# EAGLE design XuLA2 (EAGLE 5.11)
AUTHOR: Dave Vandenbout / XESS Corp.; DIGIKEY#: 742C083472JPCT-ND; MANF: XILINX; MANF#: 742C083472JPTR; MOUSER#: 774-742C083472JP; VERSION#: 2.0

## Sheet 1 of 3
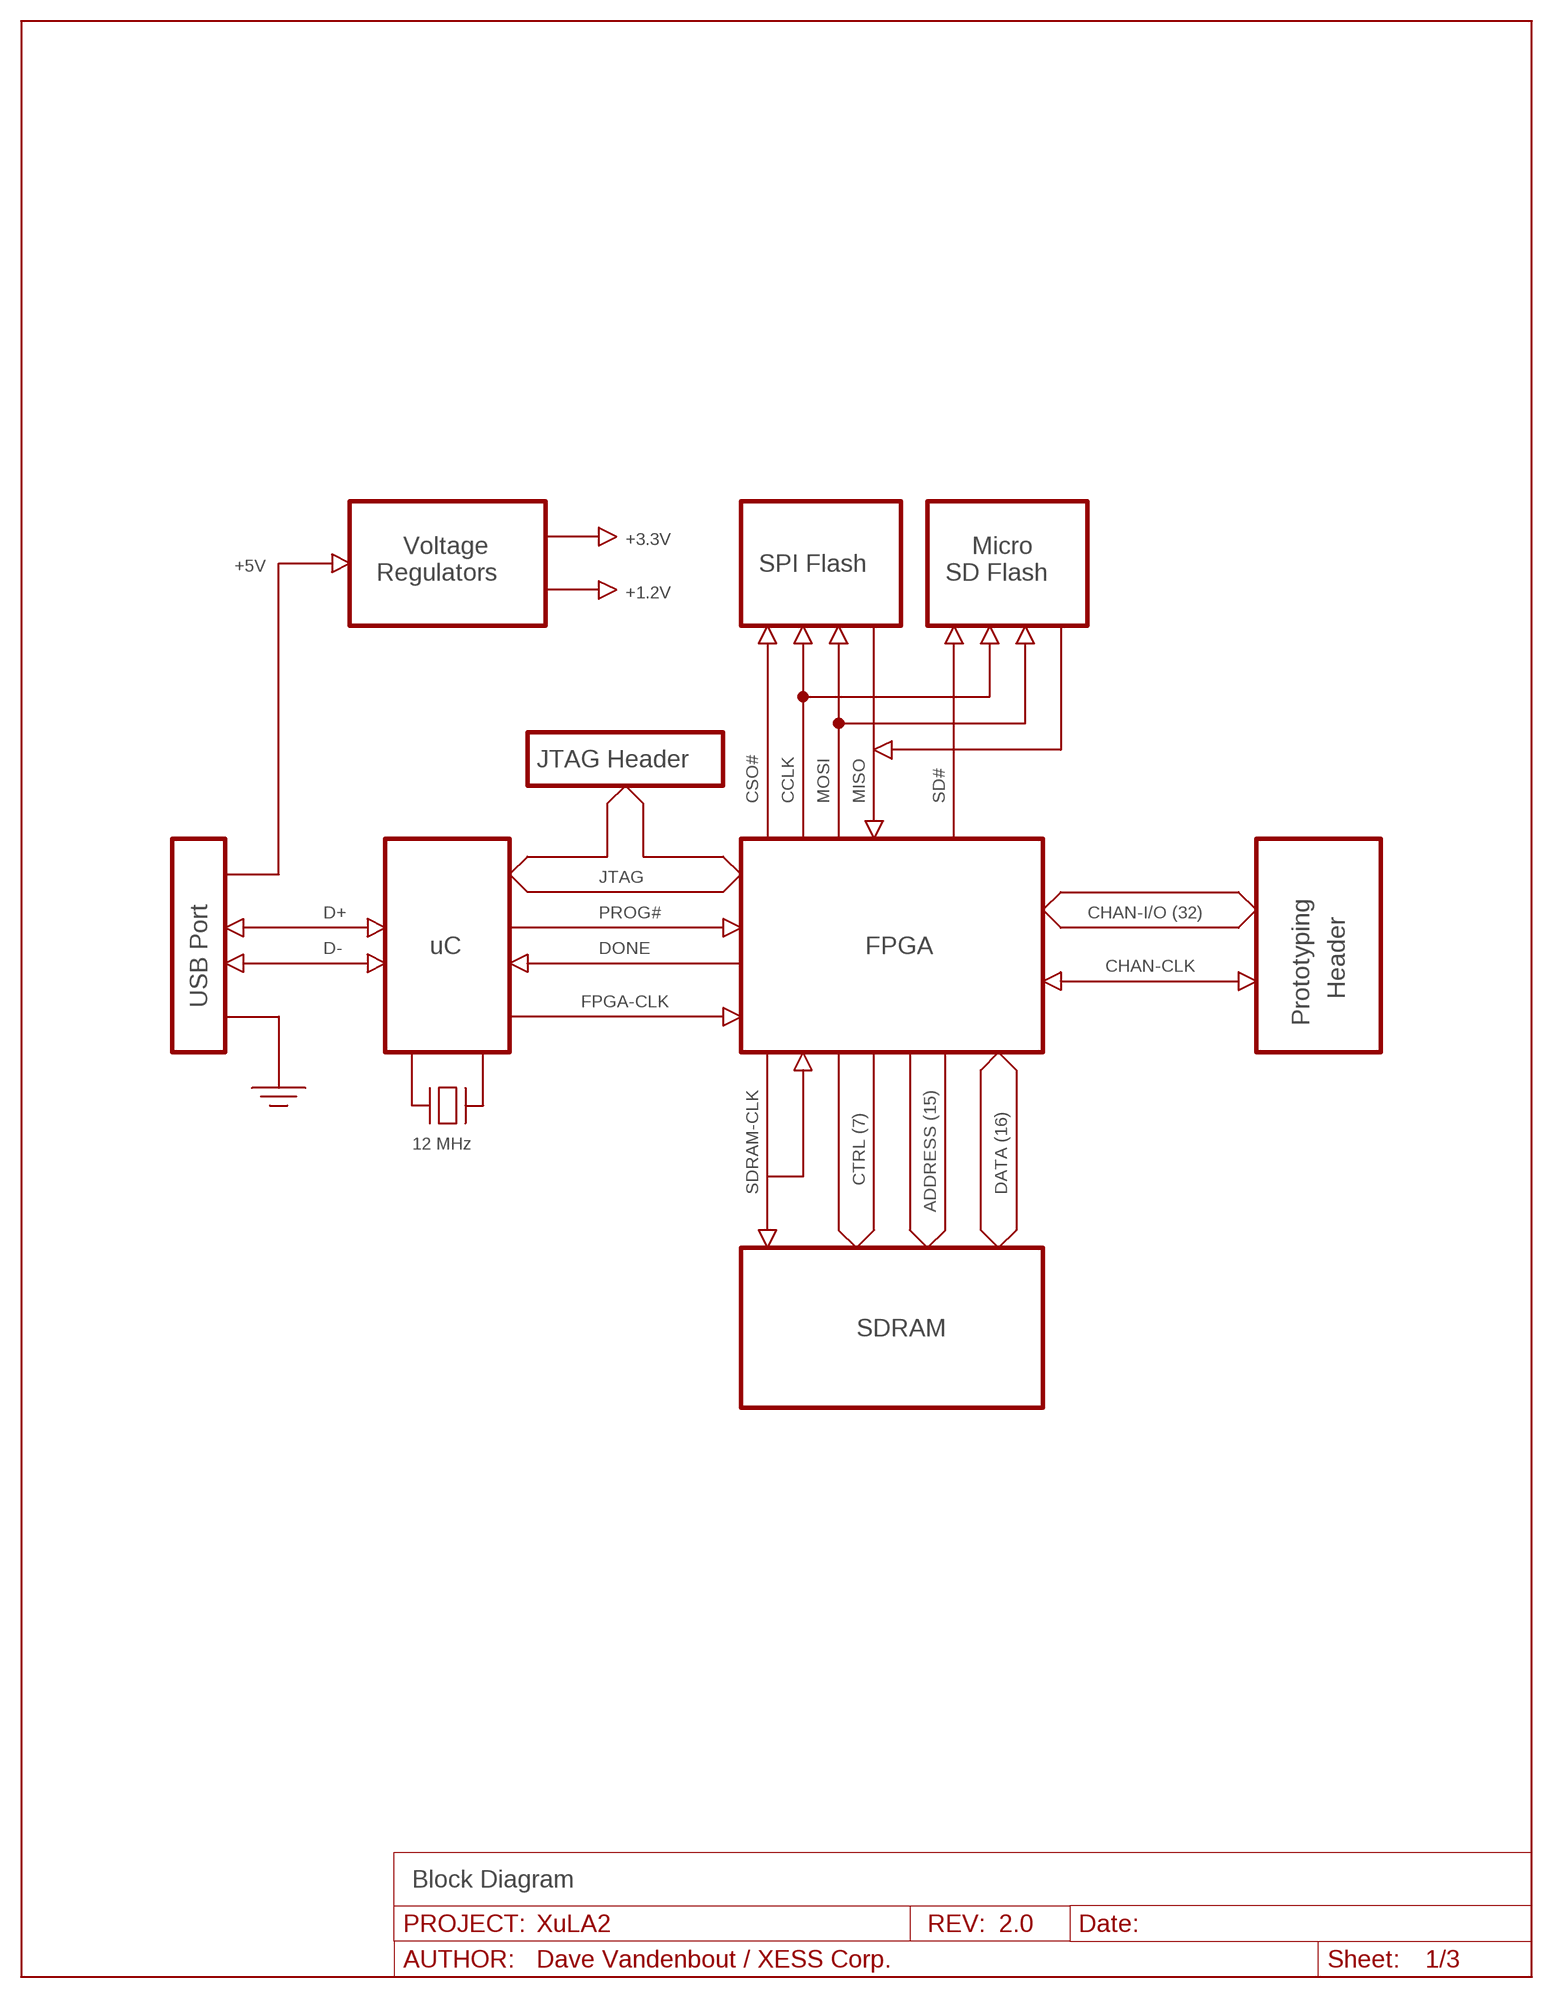
[diagram p0: schematic, sheet 1]

### Notes on the sheet
- +3.3V
- Voltage | Micro
- +5V | SPI Flash
- Regulators | SD Flash
- +1.2V
- JTAG Header
- CSO# | CCLK | MOSI | MISO | SD#
- JTAG
- D+ | PROG# | CHAN-I/O (32)
- D- | uC | DONE | FPGA
- CHAN-CLK
- Header
- USB Port | FPGA-CLK
- Prototyping
- 12 MHz
- CTRL (7)
- SDRAM-CLK | DATA (16)
- ADDRESS (15)
- SDRAM
- Block Diagram

## Sheet 2 of 3
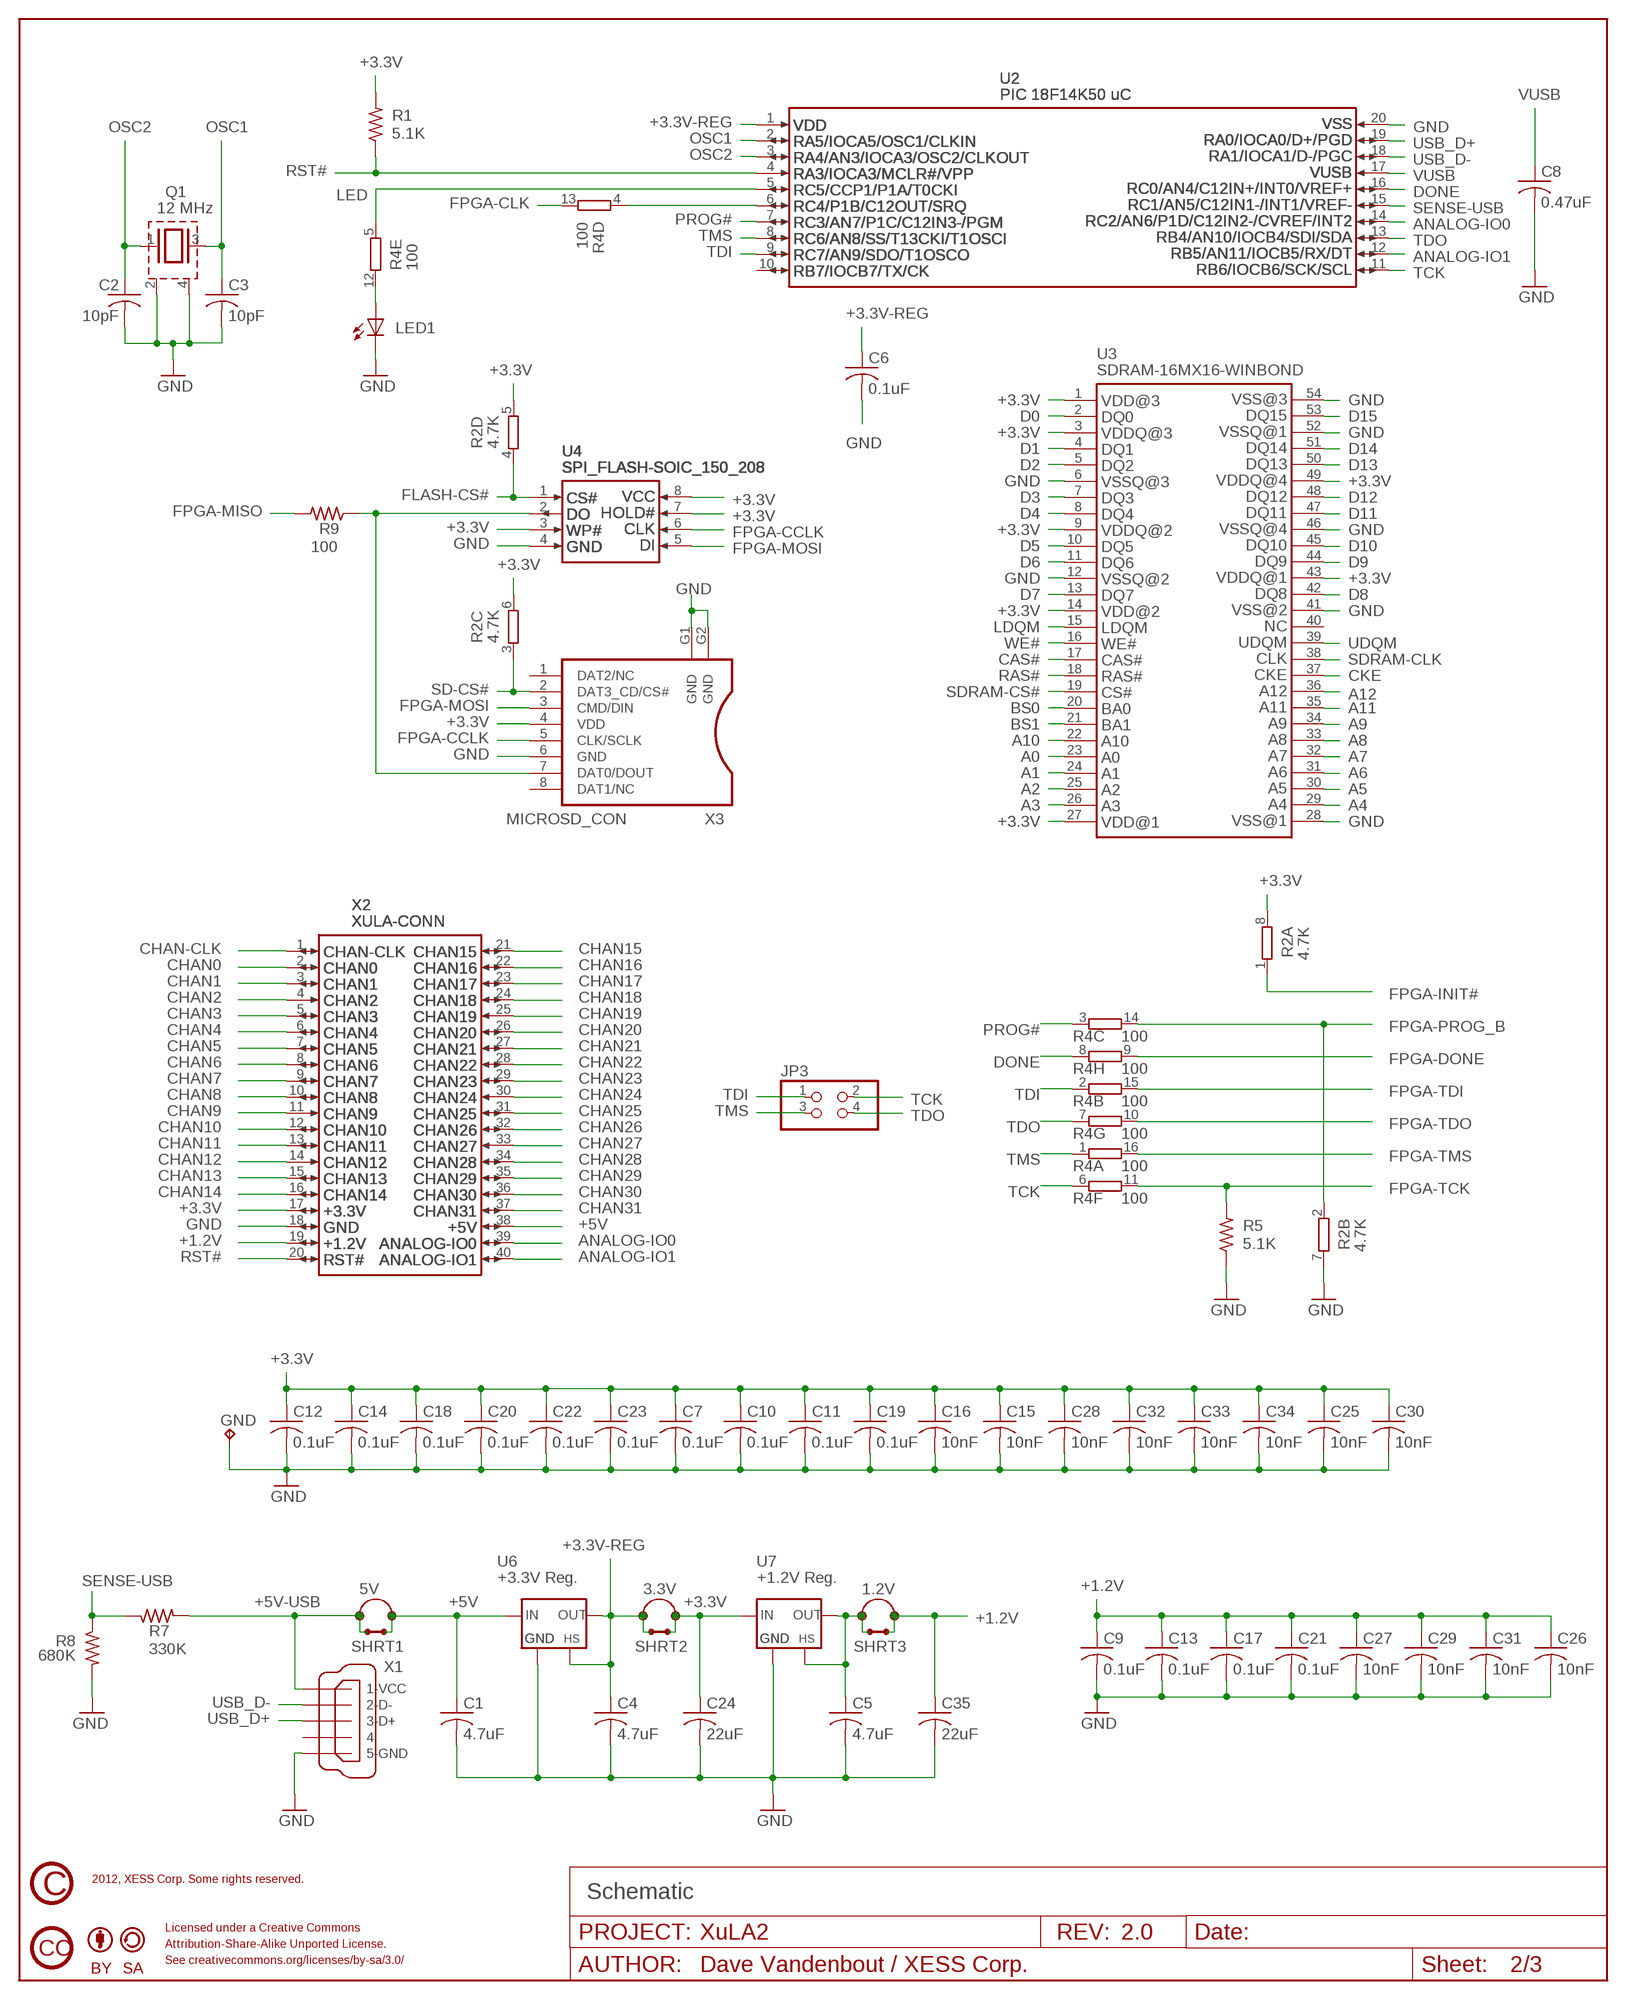
[diagram p1: schematic, sheet 2]

### Parts
1.2V  JP1QNOSILK  [JP1-NOSILK]
3.3V  JP1QNOSILK  [JP1-NOSILK]
5V  JP1QNOSILK  [JP1-NOSILK]
C1  4.7uF  C-USC0603  [C0603]
C2  10pF  C-USC0603  [C0603]
C3  10pF  C-USC0603  [C0603]
C4  4.7uF  C-USC0603  [C0603]
C5  4.7uF  C-USC0603  [C0603]
C6  0.1uF  C-USC0603  [C0603]
C7  0.1uF  C-USC0603  [C0603]
C8  0.47uF  C-USC0603  [C0603]
C9  0.1uF  C-USC0603  [C0603]
C10  0.1uF  C-USC0603  [C0603]
C11  0.1uF  C-USC0603  [C0603]
C12  0.1uF  C-USC0603  [C0603]
C13  0.1uF  C-USC0603  [C0603]
C14  0.1uF  C-USC0603  [C0603]
C15  10nF  C-USC0402  [C0402]
C16  10nF  C-USC0402  [C0402]
C17  0.1uF  C-USC0603  [C0603]
C18  0.1uF  C-USC0603  [C0603]
C19  0.1uF  C-USC0603  [C0603]
C20  0.1uF  C-USC0603  [C0603]
C21  0.1uF  C-USC0603  [C0603]
C22  0.1uF  C-USC0603  [C0603]
C23  0.1uF  C-USC0603  [C0603]
C24  22uF  C-USC1210  [C1210]
C25  10nF  C-USC0402  [C0402]
C26  10nF  C-USC0402  [C0402]
C27  10nF  C-USC0402  [C0402]
C28  10nF  C-USC0402  [C0402]
C29  10nF  C-USC0402  [C0402]
C30  10nF  C-USC0402  [C0402]
C31  10nF  C-USC0402  [C0402]
C32  10nF  C-USC0402  [C0402]
C33  10nF  C-USC0402  [C0402]
C34  10nF  C-USC0402  [C0402]
C35  22uF  C-USC1210  [C1210]
GND  TPTP-MINI  [TP-MINI]
JP3  PINHD-2X2NOSILK  [2X02-NOSILK]
LED1  LED0603  [CHIPLED-0603-TTW]
Q1  12 MHz  XTAL_CHIP32X25  [32X25]
R1  5.1K  R-US_R0603  [R0603]
R2  4.7K  RES4742  [742C083]
R4  100  RES8741X  [741X163]
R5  5.1K  R-US_R0603  [R0603]
R7  330K  R-US_R0603  [R0603]
R8  680K  R-US_R0603  [R0603]
R9  100  R-US_R0603  [R0603]
SHRT1  JSHORTWIDE  [JPSHORTW]
SHRT2  JSHORTWIDE  [JPSHORTW]
SHRT3  JSHORTWIDE  [JPSHORTW]
U2  PIC 18F14K50 uC  PIC18F14K50-I/SS  [MICROCHIP-20_SSOP]
U3  SDRAM-16MX16-WINBOND  [TSOPII-54]
U4  SPI_FLASH-SOIC_150_208  [SPI-8_SOIC_150_208]
U6  +3.3V Reg.  FAN1117  [SOT223]
U7  +1.2V Reg.  FAN1112  [SOT223]
U$2  CC_CC  [CC_CC]
U$3  CC_BY  [CC_BY]
U$4  CC_SA  [CC_SA]
U$5  CC_COPYRIGHT  [CC_COPYRIGHT]
X1  MINI-USB-UX60SC-MB-5STUX60SC-MB-5ST  MINI-USB-UX60SC-MB-5ST  [UX60SC-MB-5ST]
X2  XULA-CONN  [XULA-DIP40]
X3  MICROSD_CON  [SCHD3A0100]

### Nets
+1.2V: 1.2V.2 C9.1 C13.1 C17.1 C21.1 C26.1 C27.1 C29.1 C31.1 C35.1 SHRT3.2 X2.19 ; also sheet 3
+3.3V: 3.3V.2 C7.1 C10.1 C11.1 C12.1 C14.1 C15.1 C16.1 C18.1 C19.1 C20.1 C22.1 C23.1 C24.1 C25.1 C28.1 C30.1 C32.1 C33.1 C34.1 R1.2 R2.5 R2.6 R2.8 SHRT2.2 U3.1 U3.3 U3.9 U3.14 U3.27 U3.43 U3.49 U4.3 U4.7 U4.8 U7.3(IN) X2.17 X3.4(VDD) ; also sheet 3
+3.3V-REG: 3.3V.1 C4.1 C6.1 SHRT2.1 U2.1 U6.2(OUT) U6.4(HS)
+5V: 5V.2 C1.1 SHRT1.2 U6.3(IN) X2.38
+5V-USB: 5V.1 R7.2 SHRT1.1 X1.1(1-VCC)
A0: U3.23 ; also sheet 3
A1: U3.24 ; also sheet 3
A2: U3.25 ; also sheet 3
A3: U3.26 ; also sheet 3
A4: U3.29 ; also sheet 3
A5: U3.30 ; also sheet 3
A6: U3.31 ; also sheet 3
A7: U3.32 ; also sheet 3
A8: U3.33 ; also sheet 3
A9: U3.34 ; also sheet 3
A10: U3.22 ; also sheet 3
A11: U3.35 ; also sheet 3
A12: U3.36 ; also sheet 3
ANALOG-IO0: U2.14 X2.39
ANALOG-IO1: U2.12 X2.40
BS0: U3.20 ; also sheet 3
BS1: U3.21 ; also sheet 3
CAS#: U3.17 ; also sheet 3
CHAN0: X2.2 ; also sheet 3
CHAN1: X2.3 ; also sheet 3
CHAN2: X2.4 ; also sheet 3
CHAN3: X2.5 ; also sheet 3
CHAN4: X2.6 ; also sheet 3
CHAN5: X2.7 ; also sheet 3
CHAN6: X2.8 ; also sheet 3
CHAN7: X2.9 ; also sheet 3
CHAN8: X2.10 ; also sheet 3
CHAN9: X2.11 ; also sheet 3
CHAN10: X2.12 ; also sheet 3
CHAN11: X2.13 ; also sheet 3
CHAN12: X2.14 ; also sheet 3
CHAN13: X2.15 ; also sheet 3
CHAN14: X2.16 ; also sheet 3
CHAN15: X2.21 ; also sheet 3
CHAN16: X2.22 ; also sheet 3
CHAN17: X2.23 ; also sheet 3
CHAN18: X2.24 ; also sheet 3
CHAN19: X2.25 ; also sheet 3
CHAN20: X2.26 ; also sheet 3
CHAN21: X2.27 ; also sheet 3
CHAN22: X2.28 ; also sheet 3
CHAN23: X2.29 ; also sheet 3
CHAN24: X2.30 ; also sheet 3
CHAN25: X2.31 ; also sheet 3
CHAN26: X2.32 ; also sheet 3
CHAN27: X2.33 ; also sheet 3
CHAN28: X2.34 ; also sheet 3
CHAN29: X2.35 ; also sheet 3
CHAN30: X2.36 ; also sheet 3
CHAN31: X2.37 ; also sheet 3
CHAN-CLK: X2.1 ; also sheet 3
CKE: U3.37 ; also sheet 3
D0: U3.2 ; also sheet 3
D1: U3.4 ; also sheet 3
D2: U3.5 ; also sheet 3
D3: U3.7 ; also sheet 3
D4: U3.8 ; also sheet 3
D5: U3.10 ; also sheet 3
D6: U3.11 ; also sheet 3
D7: U3.13 ; also sheet 3
D8: U3.42 ; also sheet 3
D9: U3.44 ; also sheet 3
D10: U3.45 ; also sheet 3
D11: U3.47 ; also sheet 3
D12: U3.48 ; also sheet 3
D13: U3.50 ; also sheet 3
D14: U3.51 ; also sheet 3
D15: U3.53 ; also sheet 3
DONE: R4.8 U2.16
FLASH-CS#: R2.4 U4.1 ; also sheet 3
FPGA-CCLK: U4.6 X3.5(CLK/SCLK) ; also sheet 3
FPGA-CLK: R4.13 ; also sheet 3
FPGA-DONE: R4.9 ; also sheet 3
FPGA-INIT#: R2.1 ; also sheet 3
FPGA-MISO: R9.2 ; also sheet 3
FPGA-MOSI: U4.5 X3.3(CMD/DIN) ; also sheet 3
FPGA-PROG_B: R2.2 R4.14 ; also sheet 3
FPGA-TCK: R4.11 R5.2 ; also sheet 3
FPGA-TDI: R4.15 ; also sheet 3
FPGA-TDO: R4.10 ; also sheet 3
FPGA-TMS: R4.16 ; also sheet 3
GND: C1.2 C2.2 C3.2 C4.2 C5.2 C6.2 C7.2 C8.2 C9.2 C10.2 C11.2 C12.2 C13.2 C14.2 C15.2 C16.2 C17.2 C18.2 C19.2 C20.2 C21.2 C22.2 C23.2 C24.2 C25.2 C26.2 C27.2 C28.2 C29.2 C30.2 C31.2 C32.2 C33.2 C34.2 C35.2 GND.1(TP) LED1.C Q1.2 Q1.4 R2.7 R5.1 R8.2 U2.20 U3.6 U3.12 U3.28 U3.41 U3.46 U3.52 U3.54 U4.4 U6.1(GND) U7.1(GND) X1.5(5-GND) X2.18 X3.6(GND) X3.G1(GND) X3.G2(GND) ; also sheet 3
LDQM: U3.15 ; also sheet 3
LED: R4.5 U2.5
N$2: 1.2V.1 C5.1 SHRT3.1 U7.2(OUT) U7.4(HS)
N$7: R4.4 U2.6
N$8: R9.1 U4.2 X3.7(DAT0/DOUT)
N$11: LED1.A R4.12
OSC1: C3.1 Q1.3 U2.2
OSC2: C2.1 Q1.1 U2.3
PROG#: R4.3 U2.7
RAS#: U3.18 ; also sheet 3
RST#: R1.1 U2.4 X2.20
SD-CS#: R2.3 X3.2(DAT3_CD/CS#) ; also sheet 3
SDRAM-CLK: U3.38 ; also sheet 3
SDRAM-CS#: U3.19 ; also sheet 3
SENSE-USB: R7.1 R8.1 U2.15
TCK: JP3.2 R4.6 U2.11
TDI: JP3.1 R4.2 U2.9
TDO: JP3.4 R4.7 U2.13
TMS: JP3.3 R4.1 U2.8
UDQM: U3.39 ; also sheet 3
USB_D+: U2.19 X1.3(3-D+)
USB_D-: U2.18 X1.2(2-D-)
VUSB: C8.1 U2.17
WE#: U3.16 ; also sheet 3
Unconnected: U2.10 U3.40 X1.4 X3.1(DAT2/NC) X3.8(DAT1/NC)

### Notes on the sheet
- 2012, XESS Corp. Some rights reserved.
- Schematic
- Licensed under a Creative Commons
- Attribution-Share-Alike Unported License.
- See creativecommons.org/licenses/by-sa/3.0/

## Sheet 3 of 3
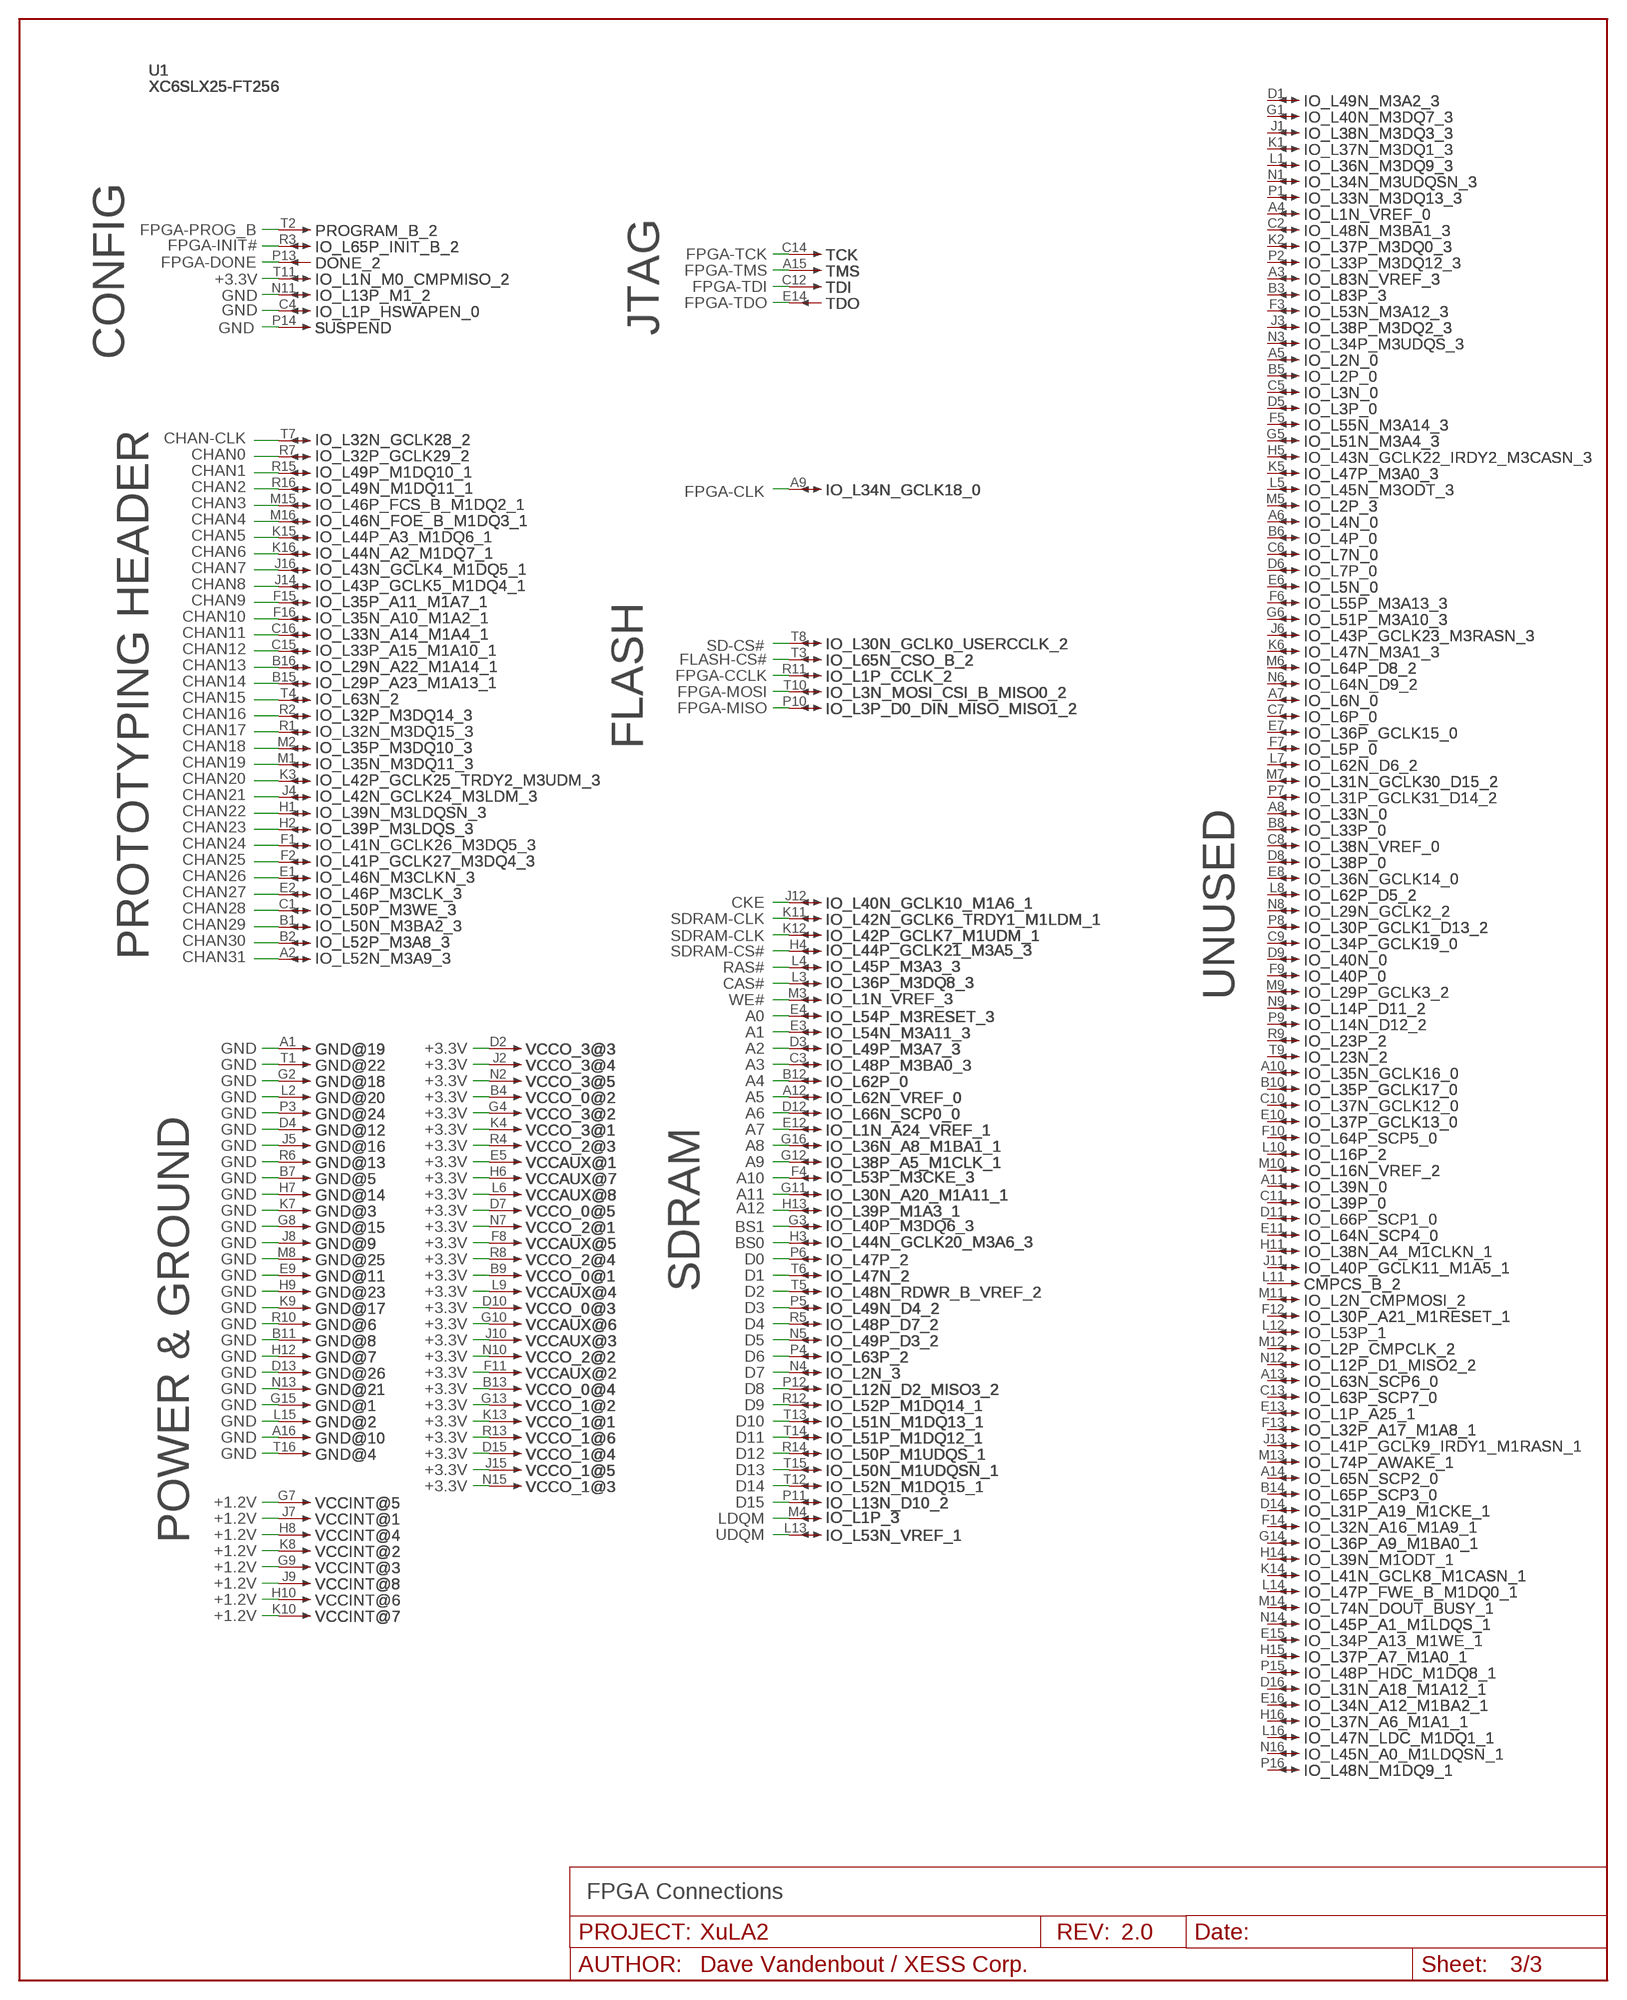
[diagram p2: schematic, sheet 3]

### Parts
U1  XC6SLX25-FT256  [XILINX-FT256]

### Nets
+1.2V: U1.G7 U1.G9 U1.H8 U1.H10 U1.J7 U1.J9 U1.K8 U1.K10 ; also sheet 2
+3.3V: U1.B4 U1.B9 U1.B13 U1.D2 U1.D7 U1.D10 U1.D15 U1.E5 U1.F8 U1.F11 U1.G4 U1.G10 U1.G13 U1.H6 U1.J2 U1.J10 U1.J15 U1.K4 U1.K13 U1.L6 U1.L9 U1.N2 U1.N7 U1.N10 U1.N15 U1.R4 U1.R8 U1.R13 U1.T11 ; also sheet 2
A0: U1.E4 ; also sheet 2
A1: U1.E3 ; also sheet 2
A2: U1.D3 ; also sheet 2
A3: U1.C3 ; also sheet 2
A4: U1.B12 ; also sheet 2
A5: U1.A12 ; also sheet 2
A6: U1.D12 ; also sheet 2
A7: U1.E12 ; also sheet 2
A8: U1.G16 ; also sheet 2
A9: U1.G12 ; also sheet 2
A10: U1.F4 ; also sheet 2
A11: U1.G11 ; also sheet 2
A12: U1.H13 ; also sheet 2
BS0: U1.H3 ; also sheet 2
BS1: U1.G3 ; also sheet 2
CAS#: U1.L3 ; also sheet 2
CHAN0: U1.R7 ; also sheet 2
CHAN1: U1.R15 ; also sheet 2
CHAN2: U1.R16 ; also sheet 2
CHAN3: U1.M15 ; also sheet 2
CHAN4: U1.M16 ; also sheet 2
CHAN5: U1.K15 ; also sheet 2
CHAN6: U1.K16 ; also sheet 2
CHAN7: U1.J16 ; also sheet 2
CHAN8: U1.J14 ; also sheet 2
CHAN9: U1.F15 ; also sheet 2
CHAN10: U1.F16 ; also sheet 2
CHAN11: U1.C16 ; also sheet 2
CHAN12: U1.C15 ; also sheet 2
CHAN13: U1.B16 ; also sheet 2
CHAN14: U1.B15 ; also sheet 2
CHAN15: U1.T4 ; also sheet 2
CHAN16: U1.R2 ; also sheet 2
CHAN17: U1.R1 ; also sheet 2
CHAN18: U1.M2 ; also sheet 2
CHAN19: U1.M1 ; also sheet 2
CHAN20: U1.K3 ; also sheet 2
CHAN21: U1.J4 ; also sheet 2
CHAN22: U1.H1 ; also sheet 2
CHAN23: U1.H2 ; also sheet 2
CHAN24: U1.F1 ; also sheet 2
CHAN25: U1.F2 ; also sheet 2
CHAN26: U1.E1 ; also sheet 2
CHAN27: U1.E2 ; also sheet 2
CHAN28: U1.C1 ; also sheet 2
CHAN29: U1.B1 ; also sheet 2
CHAN30: U1.B2 ; also sheet 2
CHAN31: U1.A2 ; also sheet 2
CHAN-CLK: U1.T7 ; also sheet 2
CKE: U1.J12 ; also sheet 2
D0: U1.P6 ; also sheet 2
D1: U1.T6 ; also sheet 2
D2: U1.T5 ; also sheet 2
D3: U1.P5 ; also sheet 2
D4: U1.R5 ; also sheet 2
D5: U1.N5 ; also sheet 2
D6: U1.P4 ; also sheet 2
D7: U1.N4 ; also sheet 2
D8: U1.P12 ; also sheet 2
D9: U1.R12 ; also sheet 2
D10: U1.T13 ; also sheet 2
D11: U1.T14 ; also sheet 2
D12: U1.R14 ; also sheet 2
D13: U1.T15 ; also sheet 2
D14: U1.T12 ; also sheet 2
D15: U1.P11 ; also sheet 2
FLASH-CS#: U1.T3 ; also sheet 2
FPGA-CCLK: U1.R11 ; also sheet 2
FPGA-CLK: U1.A9 ; also sheet 2
FPGA-DONE: U1.P13 ; also sheet 2
FPGA-INIT#: U1.R3 ; also sheet 2
FPGA-MISO: U1.P10 ; also sheet 2
FPGA-MOSI: U1.T10 ; also sheet 2
FPGA-PROG_B: U1.T2 ; also sheet 2
FPGA-TCK: U1.C14 ; also sheet 2
FPGA-TDI: U1.C12 ; also sheet 2
FPGA-TDO: U1.E14 ; also sheet 2
FPGA-TMS: U1.A15 ; also sheet 2
GND: U1.A1 U1.A16 U1.B7 U1.B11 U1.C4 U1.D4 U1.D13 U1.E9 U1.G2 U1.G8 U1.G15 U1.H7 U1.H9 U1.H12 U1.J5 U1.J8 U1.K7 U1.K9 U1.L2 U1.L15 U1.M8 U1.N11 U1.N13 U1.P3 U1.P14 U1.R6 U1.R10 U1.T1 U1.T16 ; also sheet 2
LDQM: U1.M4 ; also sheet 2
RAS#: U1.L4 ; also sheet 2
SD-CS#: U1.T8 ; also sheet 2
SDRAM-CLK: U1.K11 U1.K12 ; also sheet 2
SDRAM-CS#: U1.H4 ; also sheet 2
UDQM: U1.L13 ; also sheet 2
WE#: U1.M3 ; also sheet 2
Unconnected: U1.A3 U1.A4 U1.A5 U1.A6 U1.A7 U1.A8 U1.A10 U1.A11 U1.A13 U1.A14 U1.B3 U1.B5 U1.B6 U1.B8 U1.B10 U1.B14 U1.C2 U1.C5 U1.C6 U1.C7 U1.C8 U1.C9 U1.C10 U1.C11 U1.C13 U1.D1 U1.D5 U1.D6 U1.D8 U1.D9 U1.D11 U1.D14 U1.D16 U1.E6 U1.E7 U1.E8 U1.E10 U1.E11 U1.E13 U1.E15 U1.E16 U1.F3 U1.F5 U1.F6 U1.F7 U1.F9 U1.F10 U1.F12 U1.F13 U1.F14 U1.G1 U1.G5 U1.G6 U1.G14 U1.H5 U1.H11 U1.H14 U1.H15 U1.H16 U1.J1 U1.J3 U1.J6 U1.J11 U1.J13 U1.K1 U1.K2 U1.K5 U1.K6 U1.K14 U1.L1 U1.L5 U1.L7 U1.L8 U1.L10 U1.L11 U1.L12 U1.L14 U1.L16 U1.M5 U1.M6 U1.M7 U1.M9 U1.M10 U1.M11 U1.M12 U1.M13 U1.M14 U1.N1 U1.N3 U1.N6 U1.N8 U1.N9 U1.N12 U1.N14 U1.N16 U1.P1 U1.P2 U1.P7 U1.P8 U1.P9 U1.P15 U1.P16 U1.R9 U1.T9

### Notes on the sheet
- JTAG
- CONFIG
- FLASH
- PROTOTYPING HEADER
- UNUSED
- SDRAM
- POWER & GROUND
- FPGA Connections

## Library data of the parts
1.2V 3.3V 5V = xess:JP1Q: JUMPER
C1-C35 = rcl:C-US: CAPACITOR, American symbol
GND = xess:TP: Test Point
JP3 = pinhead:PINHD-2X2: PIN HEADER
LED1 = xess:LED: LED
Q1 = xess:XTAL_CHIP: Crystal Chip; DIGIKEY#: 535-10901-1-ND; MANF: Abracon; MANF#: ABM8G-12.000MHZ-4Y-T3; MOUSER#: 815-ABM8G-12-B4Y-T
R1 R5 R7-R9 = rcl:R-US_: RESISTOR, American symbol
R2 = xess:RES4: Resistor 4-pack Package of four resistors.; DIGIKEY#: 742C083???JPCT-ND; MANF: CTS Resistor Products; MANF#: 742C083???JPTR; MOUSER#: 774-742C083???JP
R4 = xess:RES8: Resistor 8-pack Package of eight resistors.
SHRT1-SHRT3 = xess:JSHORT: Bridge
U1 = xess:XC6SLX25-FT256: Xilinx Spartan 6 25-KLUT FPGA in FT256 package
U2 = xess:PIC18F14K50: Microchip PIC 18F14K50 Microcontroller; DIGIKEY#: PIC18F14K50-I/SS-ND; MANF: Microchip; MANF#: PIC18F14K50-I/SS; MOUSER#: 579-PIC18F14K50-I/SS
U3 = xess:SDRAM-16MX16; MANF: Winbond; MANF#: W9825G6JH-5
U4 = xess:SPI_FLASH: SPI Flash; MANF: Winbond
U6 = xess:FAN1117: +3.3V Linear Regulator
U7 = xess:FAN1112: +1.2V Linear Regulator
U$2 = xess:CC_CC
U$3 = xess:CC_BY
U$4 = xess:CC_SA
U$5 = xess:CC_COPYRIGHT
X1 = xess:MINI-USB-: MINI USB Connector Source: http://www.hirose.co.jp/cataloge_hp/e24000019.pdf; DIGIKEY#: H11671CT-ND; MANF: Hirose; MANF#: UX60SC-MB-5ST; MOUSER#: 798-UX60SC-MB-5ST
X2 = xess:XULA-CONN: XuLA Board Connector
X3 = xess:MICROSD_CON: MicroSD Card Connector

## Net classes
1 power: clearance 0.254 mm

## Board
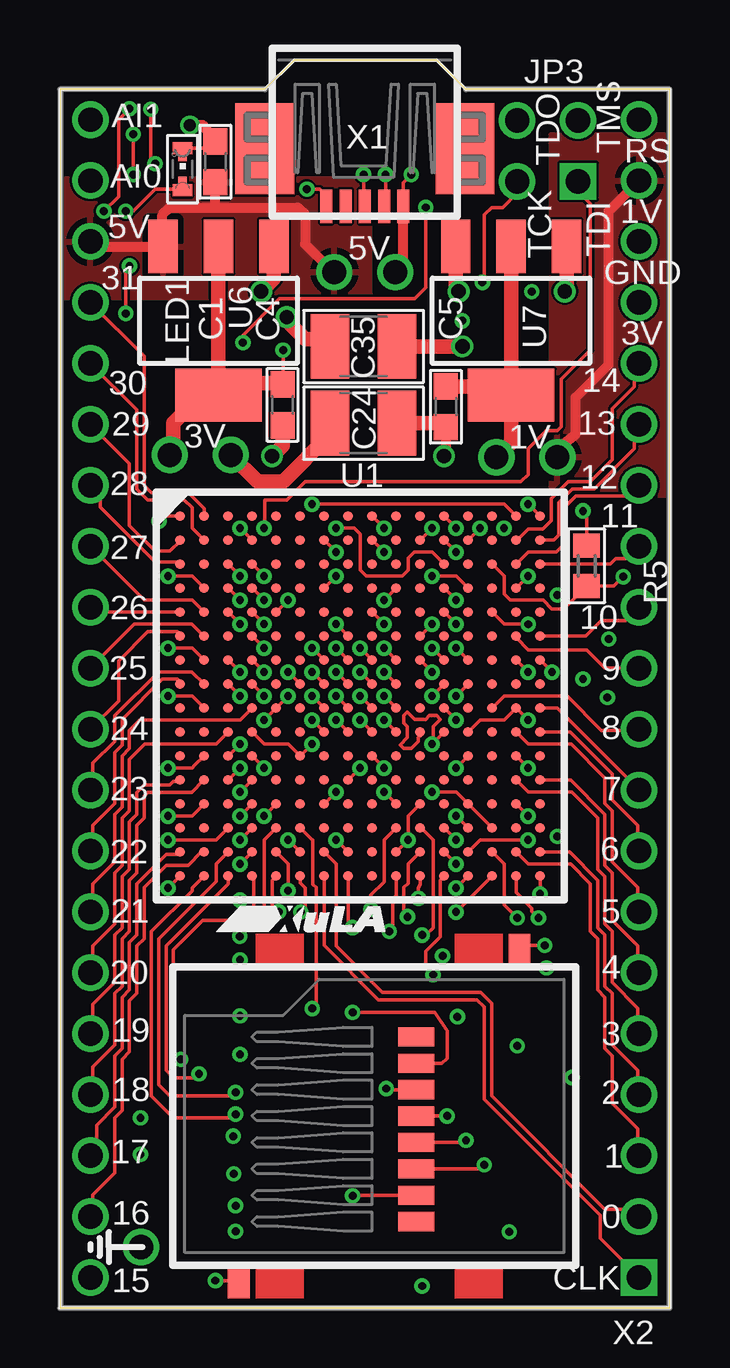
[diagram p3: board, top side]
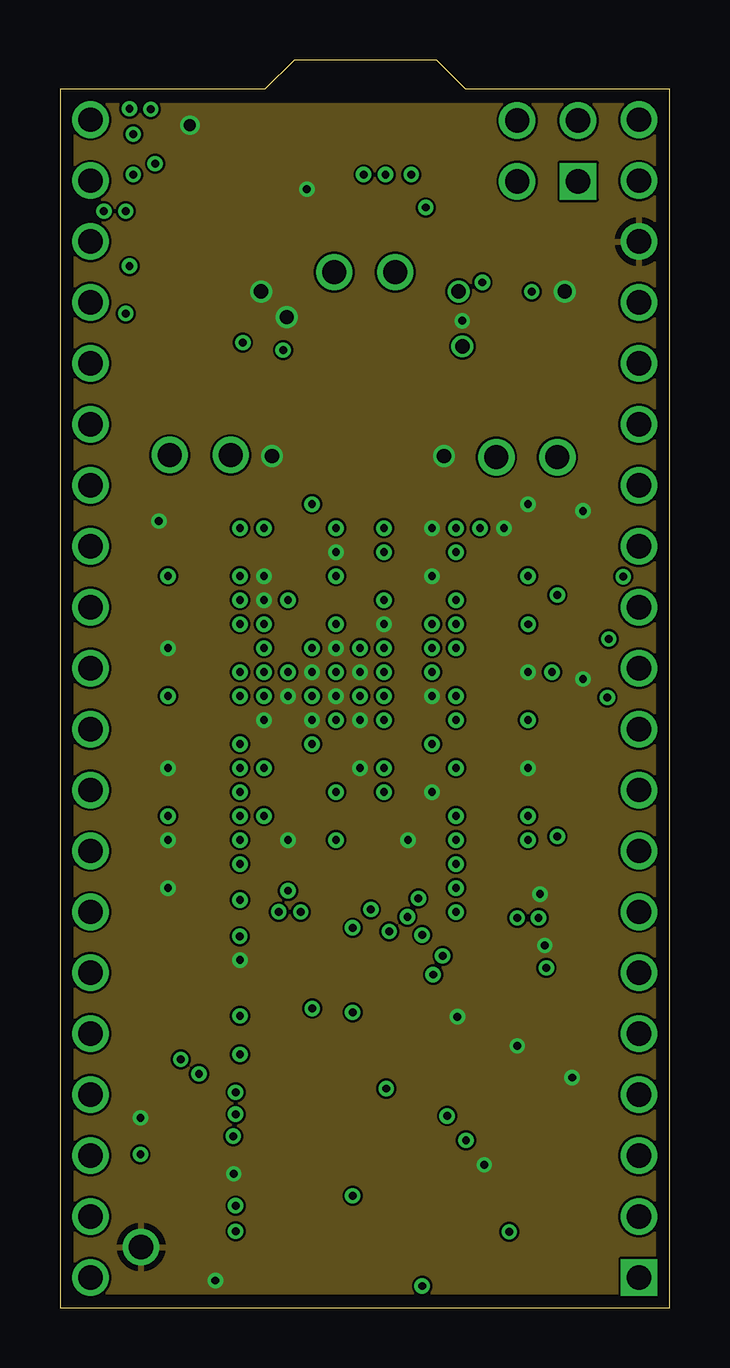
[diagram p4: board, inner layer Route2]
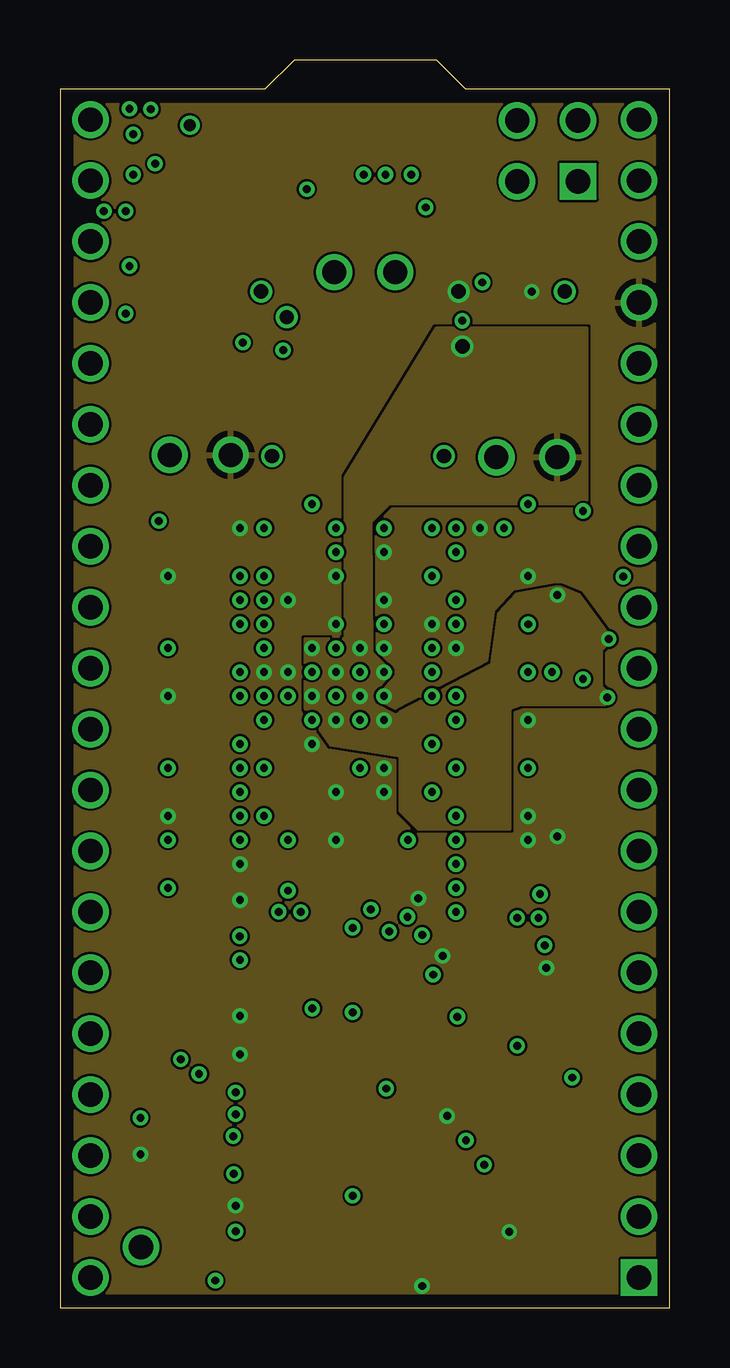
[diagram p5: board, inner layer Route3]
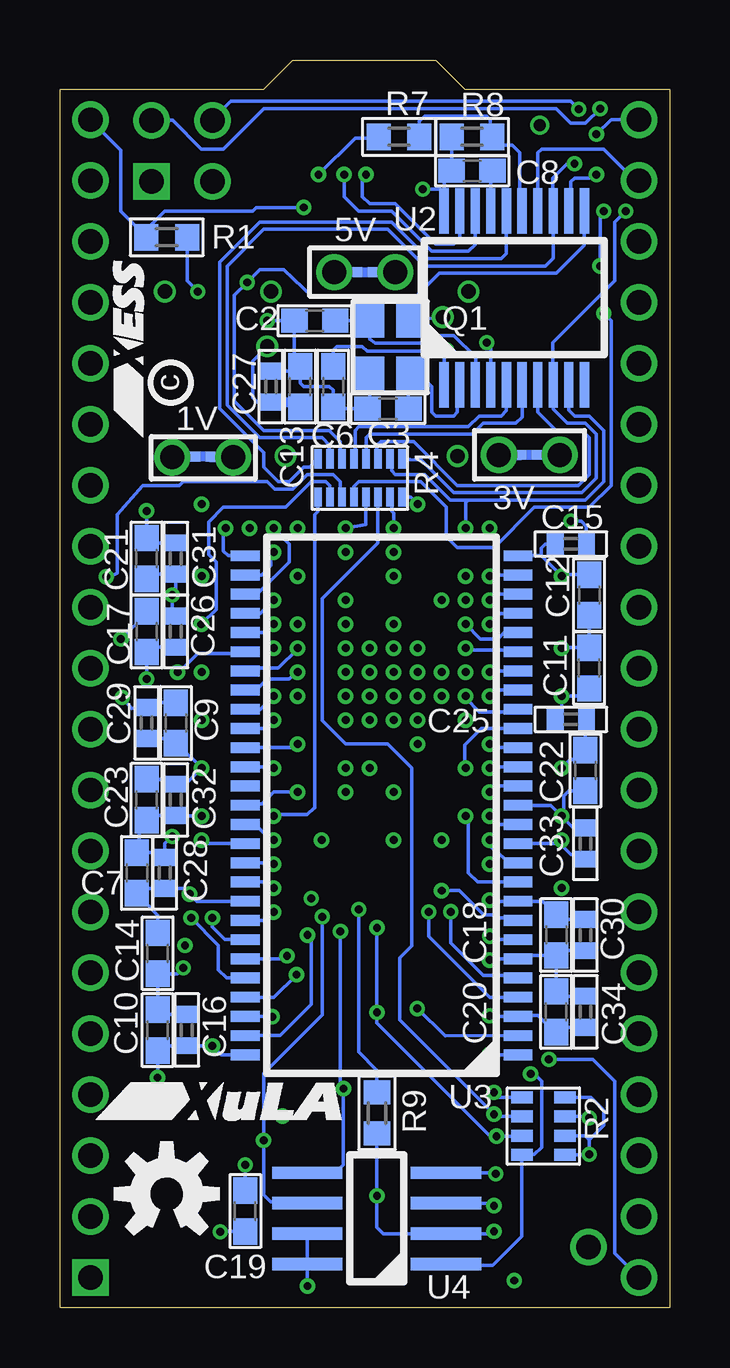
[diagram p6: board, bottom side, seen from below]

Size 25.4 x 52.02 mm. Coordinates in mm from the lower left corner, seen from the top.
Outline: 0,50.8 0,0 25.4,0 25.4,50.8 16.92,50.8 15.7,52.02 9.75,52.02 8.53,50.8 0,50.8
Copper layers (1*2*3*16): Top 0.035mm / dielectric 0.126mm / Route2 0.035mm / dielectric 1.626mm / Route3 0.035mm / dielectric 0.126mm / Bottom 0.035mm
Design rules "SEP_4layer *": minimum track width 5mil, minimum drill 10mil, track to track 0.1mm, track to pad 0.1295mm, pad to pad 0.1mm, via to via 0.1mm, smd to smd 0.1mm, copper to edge 0.15mm, drill to drill 0.2mm, minimum pad ring 10mil, minimum via ring 6mil, stop-mask expansion 2mil, vias tented up to drill 0.6071mm, thermal gap 10mil

### Footprints (pad centres in the part's own frame; a part is rotated, then mirrored left to right if it is on the bottom)
JP1-NOSILK = drill 1 round: 1 0,-1.27; 2 0,1.27
C0603 = smd 1.1 x 1: 1 -0.85,0; 2 0.85,0
C0402 = smd 0.7 x 0.9: 1 -0.65,0; 2 0.65,0
C1210 = smd 1.6 x 2.7: 1 -1.4,0; 2 1.4,0
TP-MINI = drill 1.016 round: 1 0,0
2X02-NOSILK = drill 1.016 square: 1 -1.27,-1.27 | drill 1.016 round: 2 -1.27,1.27; 3 1.27,-1.27; 4 1.27,1.27
CHIPLED-0603-TTW = smd 0.8 x 0.5: A 0,-0.875; C 0,0.875 | smd 0.35 x 0.35: A@1 0,-0.5; C@1 0,0.5
32X25 = smd 1.2 x 1.4: 1 0,0; 2 0,-2.2; 3 1.7,-2.2; 4 1.7,0
R0603 = smd 1 x 1.1: 1 -0.85,0; 2 0.85,0
742C083 = smd 0.5 x 0.9: 1 -0.4,-0.9; 2 0.4,-0.9; 3 1.2,-0.9; 4 2,-0.9; 5 2,0.9; 6 1.2,0.9; 7 0.4,0.9; 8 -0.4,0.9
741X163 = smd 0.3 x 0.8: 1 -1.75,-0.8; 2 -1.25,-0.8; 3 -0.75,-0.8; 4 -0.25,-0.8; 5 0.25,-0.8; 6 0.75,-0.8; 7 1.25,-0.8; 8 1.75,-0.8; 9 1.75,0.8; 10 1.25,0.8; 11 0.75,0.8; 12 0.25,0.8; 13 -0.25,0.8; 14 -0.75,0.8; 15 -1.25,0.8; 16 -1.75,0.8
JPSHORTW = smd 0.406 x 0.406: 1 0,0; 2 0.635,0
XILINX-FT256 = smd 0.4 x 0.4: A1 0,0; A2 1,0; A3 2,0; A4 3,0; A5 4,0; A6 5,0; A7 6,0; A8 7,0; A9 8,0; A10 9,0; A11 10,0; A12 11,0; A13 12,0; A14 13,0; A15 14,0; A16 15,0; B1 0,-1; B2 1,-1; B3 2,-1; B4 3,-1; B5 4,-1; B6 5,-1; B7 6,-1; B8 7,-1; B9 8,-1; B10 9,-1; B11 10,-1; B12 11,-1; B13 12,-1; B14 13,-1; B15 14,-1; B16 15,-1; C1 0,-2; C2 1,-2; C3 2,-2; C4 3,-2; C5 4,-2; C6 5,-2; C7 6,-2; C8 7,-2; C9 8,-2; C10 9,-2; C11 10,-2; C12 11,-2; C13 12,-2; C14 13,-2; C15 14,-2; C16 15,-2; D1 0,-3; D2 1,-3; D3 2,-3; D4 3,-3; D5 4,-3; D6 5,-3; D7 6,-3; D8 7,-3; D9 8,-3; D10 9,-3; D11 10,-3; D12 11,-3; D13 12,-3; D14 13,-3; D15 14,-3; D16 15,-3; E1 0,-4; E2 1,-4; E3 2,-4; E4 3,-4; E5 4,-4; E6 5,-4; E7 6,-4; E8 7,-4; E9 8,-4; E10 9,-4; E11 10,-4; E12 11,-4; E13 12,-4; E14 13,-4; E15 14,-4; E16 15,-4; F1 0,-5; F2 1,-5; F3 2,-5; F4 3,-5; F5 4,-5; F6 5,-5; F7 6,-5; F8 7,-5; F9 8,-5; F10 9,-5; F11 10,-5; F12 11,-5; F13 12,-5; F14 13,-5; F15 14,-5; F16 15,-5; G1 0,-6; G2 1,-6; G3 2,-6; G4 3,-6; G5 4,-6; G6 5,-6; G7 6,-6; G8 7,-6; G9 8,-6; G10 9,-6; G11 10,-6; G12 11,-6; G13 12,-6; G14 13,-6; G15 14,-6; G16 15,-6; H1 0,-7; H2 1,-7; H3 2,-7; H4 3,-7; H5 4,-7; H6 5,-7; H7 6,-7; H8 7,-7; H9 8,-7; H10 9,-7; H11 10,-7; H12 11,-7; H13 12,-7; H14 13,-7; H15 14,-7; H16 15,-7; J1 0,-8; J2 1,-8; J3 2,-8; J4 3,-8; J5 4,-8; J6 5,-8; J7 6,-8; J8 7,-8; J9 8,-8; J10 9,-8; J11 10,-8; J12 11,-8; J13 12,-8; J14 13,-8; J15 14,-8; J16 15,-8; K1 0,-9; K2 1,-9; K3 2,-9; K4 3,-9; K5 4,-9; K6 5,-9; K7 6,-9; K8 7,-9; K9 8,-9; K10 9,-9; K11 10,-9; K12 11,-9; K13 12,-9; K14 13,-9; K15 14,-9; K16 15,-9; L1 0,-10; L2 1,-10; L3 2,-10; L4 3,-10; L5 4,-10; L6 5,-10; L7 6,-10; L8 7,-10; L9 8,-10; L10 9,-10; L11 10,-10; L12 11,-10; L13 12,-10; L14 13,-10; L15 14,-10; L16 15,-10; M1 0,-11; M2 1,-11; M3 2,-11; M4 3,-11; M5 4,-11; M6 5,-11; M7 6,-11; M8 7,-11; M9 8,-11; M10 9,-11; M11 10,-11; M12 11,-11; M13 12,-11; M14 13,-11; M15 14,-11; M16 15,-11; N1 0,-12; N2 1,-12; N3 2,-12; N4 3,-12; N5 4,-12; N6 5,-12; N7 6,-12; N8 7,-12; N9 8,-12; N10 9,-12; N11 10,-12; N12 11,-12; N13 12,-12; N14 13,-12; N15 14,-12; N16 15,-12; P1 0,-13; P2 1,-13; P3 2,-13; P4 3,-13; P5 4,-13; P6 5,-13; P7 6,-13; P8 7,-13; P9 8,-13; P10 9,-13; P11 10,-13; P12 11,-13; P13 12,-13; P14 13,-13; P15 14,-13; P16 15,-13; R1 0,-14; R2 1,-14; R3 2,-14; R4 3,-14; R5 4,-14; R6 5,-14; R7 6,-14; R8 7,-14; R9 8,-14; R10 9,-14; R11 10,-14; R12 11,-14; R13 12,-14; R14 13,-14; R15 14,-14; R16 15,-14; T1 0,-15; T2 1,-15; T3 2,-15; T4 3,-15; T5 4,-15; T6 5,-15; T7 6,-15; T8 7,-15; T9 8,-15; T10 9,-15; T11 10,-15; T12 11,-15; T13 12,-15; T14 13,-15; T15 14,-15; T16 15,-15
MICROCHIP-20_SSOP = smd 1.89 x 0.38: 1 0,0; 2 0,-0.65; 3 0,-1.3; 4 0,-1.95; 5 0,-2.6; 6 0,-3.25; 7 0,-3.9; 8 0,-4.55; 9 0,-5.2; 10 0,-5.85; 11 7.25,-5.85; 12 7.25,-5.2; 13 7.25,-4.55; 14 7.25,-3.9; 15 7.25,-3.25; 16 7.25,-2.6; 17 7.25,-1.95; 18 7.25,-1.3; 19 7.25,-0.65; 20 7.25,0
TSOPII-54 = smd 1.2 x 0.45: 1 0,0; 2 0,-0.8; 3 0,-1.6; 4 0,-2.4; 5 0,-3.2; 6 0,-4; 7 0,-4.8; 8 0,-5.6; 9 0,-6.4; 10 0,-7.2; 11 0,-8; 12 0,-8.8; 13 0,-9.6; 14 0,-10.4; 15 0,-11.2; 16 0,-12; 17 0,-12.8; 18 0,-13.6; 19 0,-14.4; 20 0,-15.2; 21 0,-16; 22 0,-16.8; 23 0,-17.6; 24 0,-18.4; 25 0,-19.2; 26 0,-20; 27 0,-20.8; 28 11.36,-20.8; 29 11.36,-20; 30 11.36,-19.2; 31 11.36,-18.4; 32 11.36,-17.6; 33 11.36,-16.8; 34 11.36,-16; 35 11.36,-15.2; 36 11.36,-14.4; 37 11.36,-13.6; 38 11.36,-12.8; 39 11.36,-12; 40 11.36,-11.2; 41 11.36,-10.4; 42 11.36,-9.6; 43 11.36,-8.8; 44 11.36,-8; 45 11.36,-7.2; 46 11.36,-6.4; 47 11.36,-5.6; 48 11.36,-4.8; 49 11.36,-4; 50 11.36,-3.2; 51 11.36,-2.4; 52 11.36,-1.6; 53 11.36,-0.8; 54 11.36,0
SPI-8_SOIC_150_208 = smd 2.921 x 0.51: 1 1.06,0; 2 1.06,-1.27; 3 1.06,-2.54; 4 1.06,-3.81; 5 6.839,-3.81; 6 6.839,-2.54; 7 6.839,-1.27; 8 6.839,0
SOT223 = smd 1.219 x 2.235: 1 -2.311,-3.099; 2 0,-3.099; 3 2.311,-3.099 | smd 3.6 x 2.2: 4 0,3.099
UX60SC-MB-5ST = smd 1.4 x 0.5: 1 6.1,1.6; 2 6.1,0.8; 3 6.1,0; 4 6.1,-0.8; 5 6.1,-1.6 | smd 3.8 x 2.449: M1 3.7,-4.175; M2 3.7,4.175
XULA-DIP40 = drill 1.016 square: 1 49.53,24.13 | drill 1.016 round: 2 46.99,24.13; 3 44.45,24.13; 4 41.91,24.13; 5 39.37,24.13; 6 36.83,24.13; 7 34.29,24.13; 8 31.75,24.13; 9 29.21,24.13; 10 26.67,24.13; 11 24.13,24.13; 12 21.59,24.13; 13 19.05,24.13; 14 16.51,24.13; 15 13.97,24.13; 16 11.43,24.13; 17 8.89,24.13; 18 6.35,24.13; 19 3.81,24.13; 20 1.27,24.13; 21 49.53,1.27; 22 46.99,1.27; 23 44.45,1.27; 24 41.91,1.27; 25 39.37,1.27; 26 36.83,1.27; 27 34.29,1.27; 28 31.75,1.27; 29 29.21,1.27; 30 26.67,1.27; 31 24.13,1.27; 32 21.59,1.27; 33 19.05,1.27; 34 16.51,1.27; 35 13.97,1.27; 36 11.43,1.27; 37 8.89,1.27; 38 6.35,1.27; 39 3.81,1.27; 40 1.27,1.27
SCHD3A0100 = smd 0.8 x 1.5: 1 3.3,-10.15; 2 2.2,-10.15; 3 1.1,-10.15; 4 0,-10.15; 5 -1.1,-10.15; 6 -2.2,-10.15; 7 -3.3,-10.15; 8 -4.4,-10.15 | smd 1.45 x 0.9: G1 6.875,-14.45; G2 -6.875,-2.75

### Placement (x,y rotation side)
1.2V  19.46,35.46 270 top
3.3V  5.84,35.56 270 top
5V  12.7,43.18 90 top
C1  6.48,47.78 90 top
C2  14.78,41.15 180 bottom
C3  11.73,37.49 180 bottom
C4  9.27,37.64 270 top
C5  16.08,37.57 270 top
C6  14.02,38.4 270 bottom
C7  22.2,18.14 270 bottom
C8  8.23,47.4 180 bottom
C9  20.57,24.38 270 bottom
C10  21.34,11.58 270 bottom
C11  3.35,26.67 90 bottom
C12  3.35,29.72 270 bottom
C13  15.39,38.4 90 bottom
C14  21.34,14.78 90 bottom
C15  4.11,31.85 0 bottom
C16  20.12,11.58 270 bottom
C17  21.79,28.19 270 bottom
C18  4.72,15.54 270 bottom
C19  17.68,4.04 90 bottom
C20  4.72,12.34 90 bottom
C21  21.79,31.24 90 bottom
C22  3.51,22.4 90 bottom
C23  21.79,21.18 90 bottom
C24  12.65,36.88 0 top
C25  4.11,24.54 0 bottom
C26  20.57,28.19 270 bottom
C27  16.61,38.4 90 bottom
C28  21.03,18.14 270 bottom
C29  21.79,24.38 270 bottom
C30  3.51,15.54 270 bottom
C31  20.57,31.24 90 bottom
C32  20.57,21.18 90 bottom
C33  3.51,19.35 270 bottom
C34  3.51,12.34 90 bottom
C35  12.65,40.08 180 top
GND  3.38,2.54 0 top
JP3  20.32,48.23 90 top
LED1  5.11,47.47 0 top
Q1  12.5,41.15 0 bottom
R1  20.95,44.63 0 bottom
R2  5.26,8.38 270 bottom
R4  12.9,34.59 180 bottom
R5  21.95,30.94 270 top
R7  11.28,48.82 180 bottom
R8  8.23,48.82 180 bottom
R9  12.19,8.13 90 bottom
SHRT1  13,43.18 0 bottom
SHRT2  5.54,35.56 180 bottom
SHRT3  19.13,35.48 180 bottom
U1  5,33 0 top
U2  9.4,38.48 90 bottom
U3  6.32,10.55 180 bottom
U4  8.26,1.83 180 bottom
U6  6.6,41.15 180 top
U7  18.8,41.15 180 top
U$2  -1.91,-15.88 0 top  (outside the outline)
U$3  5.08,-14.61 0 top  (outside the outline)
U$4  10.16,-14.61 0 top  (outside the outline)
U$5  -1.91,-6.99 0 top  (outside the outline)
X1  12.7,52.02 270 top
X2  0,50.8 270 top
X3  4.7,8 90 top

### Tracks (layer width: path | path; a pad name or v marks a point on that pad's centre or on a via)
+1.2V  (via drill 0.33, 0.6)
  Top 0.152: U1.G7 v10.5,27.5 | U1.H8 v11.5,26.5 | U1.H10 v13.5,26.5 | U1.K10 v13.5,24.5 | U1.J9 v12.5,25.5 | U1.J7 v10.5,25.5 | U1.K8 v11.5,24.5 | v12.5,27.5 U1.G9
  Top 0.406: 1.2V.2 20.73,35.81 21.49,36.42 21.49,37.95 22.86,39.32 22.86,45.72 X2.19
  Top 0.61: C35.1 v16.76,40.08
  Bottom 0.152: C26.1 20.73,29 v20.73,29.72 20.57,29.87 C31.1 21.59,30.59 C21.1 | C17.1 21.79,28.96 v22.86,27.89 | v22.81,25.45 22.4,24.99 C29.1 21.59,25.23 C9.1 | C27.1 17.18,37.76 17.37,37.95 17.37,39.47 v16.76,40.08
  Bottom 0.406: C27.1 15.59,37.76 C13.1 | SHRT3.2 20.7,35.48 1.2V.2
  pour Route3: 10.21,27.89 10.21,24.99 11.28,23.47 14.17,23.01 14.17,20.73 14.94,19.96 18.75,19.96 18.75,24.99 19.2,25.15 22.71,25.15 22.96,25.4 22.96,25.5 22.56,25.91 22.56,27.43 22.96,27.84 22.96,27.91 21.64,29.72 20.78,30.07 19.02,29.77 18.29,28.96 17.98,26.82 14.17,24.84 14.02,24.69 13.11,25.15 13.08,25.17 13.08,25.65 13.79,26.52 12.98,27.33 12.95,32.77 13.72,33.53 21.95,33.53 21.95,40.84 15.7,40.84 11.89,34.59 11.89,27.89
  pour Top: 25.45,48.92 20.42,48.92 20.42,33.83 25.45,33.83
+3.3V  (via drill 0.33, 0.6)
  Top 0.152: v7.5,32.5 U1.B4 | U1.E5 v9.5,29.5 | U1.D7 v11.5,30.5 | U1.F8 v11.5,28.5 | U1.B9 v13.5,31.5 | U1.D10 v13.5,29.5 | U1.G10 v13.5,27.5 | U1.F11 v15.5,28.5 | U1.J10 v13.5,25.5 | v13.5,22.5 U1.L9 | v10.5,23.5 U1.L6 9.5,23.5 8.5,23.5 U1.K4 | U1.N7 v11.5,21.5 | U1.R8 v11.5,19.5 | U1.N10 v13.5,21.5 | U1.D15 v19.5,30.5 | U1.B13 v17.5,32.5 | U1.G4 v8.5,26.5 | U1.H6 v9.5,26.5 | U1.G13 v16.5,27.5 | U1.N15 v19.5,20.5 | U1.R13 17.5,19.5 v19.5,19.5 | v19.5,24.5 U1.J15 18.5,24.5 17.5,24.5 U1.K13 | U1.D2 5.5,30.5 v4.5,30.5 | U1.N2 5.5,20.5 v4.5,20.5 | v7.5,18.5 U1.R4 | U1.J2 5.5,25.5 v4.5,25.5 | U1.T11 15,17.65 14.94,17.5 v14.94,17.07 | X3.4 v16.13,8
  Top 0.61: U7.3 16.48,42.65 v16.61,42.37 | 7.16,35.51 3.3V.2 8.23,34.44 9.3,34.44 11.25,36.4 C24.1
  Bottom 0.152: 5.35,31.35 U3.27 | 5.35,31.35 v4.5,30.5 4.43,30.57 C12.1 | v7.5,17 7.43,16.95 U3.9 5.28,16.95 C18.1 4.52,16.2 C30.1 | v7.5,12.18 7.45,12.15 U3.3 6.28,12.19 5.49,12.19 4.79,11.49 C20.1 4.52,11.69 C34.1 | U3.1 7.2,10.55 v7.5,10.58 | U3.49 16.12,14.55 v15.94,14.68 | U3.43 19.35,19.35 v19.5,19.5 | C33.1 4,20 v4.5,20.5 | U3.14 4.95,20.95 v4.5,20.5 | C22.1 4.2,21.55 4.42,21.34 4.42,20.58 v4.5,20.5 | U4.3 7.57,4.37 v7.32,4.27 | U4.7 U4.8 15.09,1.07 v15.09,0.91 | 5.35,31.35 5.35,31.68 5.18,31.85 C15.1 | C11.1 3.67,25.5 v4.5,25.5 4.5,24.8 C25.1 | v19.5,20.5 20.54,20.5 C32.1 21.59,20.53 C23.1 21.79,20.27 22.1,19.96 22.1,19.14 C7.1 21.23,18.99 C28.1 21.03,19.36 v20.73,19.66 | C16.1 21.14,12.23 C10.1 C14.1 20.51,13.93 v20.27,14.17 | R1.2 20.11,42.81 v19.66,42.37 | R2.8 3.3,8.78 2.74,8.23 2.74,7.62 3.35,7.01 | 3.35,7.01 v3.35,6.4 3.37,6.38 R2.5 | R2.6 3.52,7.18 3.35,7.01 | C19.1 18.66,3.19 v18.72,3.17
  Bottom 0.406: 3.3V.2 SHRT2.2
  pour Route3 (rank 2): 0.64,50.16 24.77,50.16 24.77,0.64 0.64,0.64
+3.3V-REG  (via drill 0.33)
  Top 0.152: v9.3,39.93 9.3,38.86 9.45,38.67 C4.1
  Top 0.406: 5.89,38.05 U6.4
  Top 0.61: 5.89,38.05 4.72,36.88 4.72,35.71 3.3V.1 | U6.2 U6.4 7.11,38.05 7.62,38.56 9.21,38.56 C4.1
  Bottom 0.152: U2.1 9.4,39.88 v9.3,39.93 9.37,39.93 9.42,39.88 12.6,39.88 12.8,40.08 13.87,40.08 14.02,39.93 C6.1
  Bottom 0.406: 3.3V.1 SHRT2.1
+5V
  Top 0.406: 5V.2 11.43,43.13 10.21,44.35 10.21,45.57 9.91,45.87 6.4,45.87 | 6.4,45.87 4.57,45.87 4.27,45.57 4.27,44.22 U6.3 1.47,44.25 X2.38 | C1.1 6.48,45.95 6.4,45.87
  Bottom 0.406: 5V.2 SHRT1.2
  pour Top: 0,47.09 12.95,47.09 12.95,42.06 0,42.06
+5V-USB  (via drill 0.33)
  Top 0.152: X1.1 14.3,46.91 v14.63,47.24
  Top 0.406: X1.1 14.3,43.51 5V.1
  Bottom 0.152: 12.23,48.67 R7.2 12.34,48.77 13.11,48.77 v14.63,47.24
  Bottom 0.406: SHRT1.1 5V.1
A0  (via drill 0.33)
  Top 0.152: v8.5,28.5 U1.E4
  Bottom 0.152: U3.23 6.9,28.15 7.16,27.89 7.89,27.89 v8.5,28.5
A1  (via drill 0.33)
  Top 0.152: U1.E3 v7.5,28.5
  Bottom 0.152: U3.24 7.05,28.95 v7.5,28.5
A2  (via drill 0.33)
  Top 0.152: U1.D3 v7.5,29.5
  Bottom 0.152: U3.25 7.25,29.75 v7.5,29.5
A3  (via drill 0.33)
  Top 0.152: U1.C3 v7.5,30.5
  Bottom 0.152: U3.26 7.45,30.55 v7.5,30.5
A4  (via drill 0.33)
  Top 0.152: U1.B12 v16.5,31.5
  Bottom 0.152: U3.29 17,30.55 16.61,30.94 16.61,31.39 v16.5,31.5
A5  (via drill 0.33)
  Top 0.152: v16.5,32.5 U1.A12
  Bottom 0.152: U3.30 17.19,29.75 15.85,31.09 15.85,31.85 v16.5,32.5
A6  (via drill 0.33)
  Top 0.152: U1.D12 v16.5,29.5
  Bottom 0.152: U3.31 17.05,28.95 v16.5,29.5
A7  (via drill 0.33)
  Top 0.152: U1.E12 v16.5,28.5
  Bottom 0.152: U3.32 16.85,28.15 v16.5,28.5
A8  (via drill 0.33)
  Top 0.152: v20.5,26.5 U1.G16
  Bottom 0.152: v20.5,26.5 20.44,26.5 19.66,27.28 17.75,27.28 U3.33
A9  (via drill 0.33)
  Top 0.152: U1.G12 v15.5,27.5
  Bottom 0.152: v15.5,27.5 15.5,27.48 16.31,26.67 17.56,26.67 U3.34
A10  (via drill 0.33)
  Top 0.152: v8.5,27.5 U1.F4
  Bottom 0.152: v8.5,27.5 8.3,27.5 8.23,27.43 6.4,27.43 U3.22
A11  (via drill 0.33)
  Top 0.152: U1.G11 v15.5,26.5
  Bottom 0.152: v15.5,26.5 15.56,26.5 15.85,26.21 16.76,26.21 17.07,25.91 17.52,25.91 U3.35
A12  (via drill 0.33)
  Top 0.152: v16.5,25.5 U1.H13
  Bottom 0.152: U3.36 17.05,24.95 v16.5,25.5
ANALOG-IO0
  Bottom 0.152: X2.39 1.42,46.99 2.74,48.31 5.33,48.31 5.49,48.16 5.49,45.74 U2.14
ANALOG-IO1  (via drill 0.33)
  Top 0.152: v3.05,48.92 v3.05,47.24
  Bottom 0.152: X2.40 2.44,49.53 v3.05,48.92 | v3.05,47.24 3.2,47.24 3.35,47.09 3.96,47.09 4.12,46.94 4.12,45.81 U2.12
BS0  (via drill 0.33)
  Top 0.152: U1.H3 v7.5,25.5
  Bottom 0.152: U3.20 7.25,25.75 v7.5,25.5
BS1  (via drill 0.33)
  Top 0.152: U1.G3 v7.5,26.5
  Bottom 0.152: U3.21 7.45,26.55 v7.5,26.5
CAS#  (via drill 0.33)
  Top 0.152: U1.L3 7.2,23.2 v7.5,23.5
  Bottom 0.152: U3.17 7.35,23.35 v7.5,23.5
CHAN0
  Top 0.152: U1.R7 11.5,18.5 11.5,15.09 13.44,13.16 17.53,13.16 17.98,12.7 17.98,8.84 22.71,4.12 23.82,4.12 X2.2
CHAN1
  Top 0.152: U1.R15 19.5,18.5 21.28,18.5 22.1,17.68 22.1,15.7 22.4,15.39 22.4,13.26 22.71,12.95 22.71,10.82 23.01,10.52 23.01,8.53 24.08,7.47 24.08,6.4 X2.3
CHAN2
  Top 0.152: U1.R16 21.23,19 22.4,17.83 22.4,15.85 22.71,15.54 22.71,13.41 23.01,13.11 23.01,10.97 24.08,9.91 24.08,8.94 X2.4
CHAN3
  Top 0.152: U1.M15 19.5,21.5 21.32,21.5 22.4,20.42 22.4,18.29 22.71,17.98 22.71,16 23.01,15.7 23.01,13.56 24.08,12.5 24.08,11.48 X2.5
CHAN4
  Top 0.152: U1.M16 21.28,22 22.71,20.57 22.71,18.44 23.01,18.14 23.01,16.15 24.08,15.09 24.08,14.02 X2.6
CHAN5
  Top 0.152: U1.K15 19.5,23.5 21.31,23.5 22.71,22.1 22.71,21.03 23.01,20.73 23.01,18.59 24.08,17.53 24.08,16.56 X2.7
CHAN6
  Top 0.152: U1.K16 21.26,24 23.01,22.25 23.01,21.18 24.08,20.12 24.08,19.1 X2.8
CHAN7
  Top 0.152: U1.J16 20.72,25 X2.9
CHAN8
  Top 0.152: U1.J14 18.5,25.5 21.13,25.5 22.55,24.08 24.08,24.08 X2.10
CHAN9
  Top 0.152: U1.F15 19,27.94 19.51,27.43 21.95,27.43 22.71,26.67 X2.11
CHAN10
  Top 0.152: U1.F16 21.9,28 22.55,28.65 23.57,28.65 X2.12
CHAN11
  Top 0.152: U1.C16 22.92,31 23.16,31.24 23.62,31.24 X2.13
CHAN12
  Top 0.152: U1.C15 19.5,31.5 20.68,31.5 21.08,31.9 21.08,33.43 21.49,33.83 23.67,33.83 X2.14
CHAN13
  Top 0.152: U1.B16 20.57,32 20.78,32.21 20.78,33.58 21.34,34.14 22.25,34.14 23.93,35.81 23.93,36.63 X2.15
CHAN14
  Top 0.152: U1.B15 19.05,32 19.51,32.46 20.12,32.46 20.47,32.82 20.47,33.73 21.18,34.44 22.1,34.44 23.01,35.36 23.01,37.49 23.93,38.41 23.93,39.17 X2.16
CHAN15  (via drill 0.33)
  Top 0.152: U1.T4 8,17.91 8.08,17.83 8.08,16.61 7.62,16.15 5.94,16.15 4.72,14.94 4.72,10.67 v5.03,10.36
  Bottom 0.152: v5.03,10.36 3.2,10.36 2.29,9.45 2.29,2.29 X2.21
CHAN16
  Top 0.152: X2.22 1.37,3.91 1.37,4.72 2.29,5.64 2.29,7.92 2.59,8.23 2.59,10.36 2.9,10.67 2.9,12.8 3.2,13.11 3.2,15.09 3.5,15.39 3.5,17.53 4.42,18.44 5.33,18.44 5.89,19 U1.R2
CHAN17
  Top 0.152: X2.23 1.52,6.6 1.52,7.62 2.29,8.38 2.29,10.52 2.59,10.82 2.59,12.95 2.9,13.26 2.9,15.24 3.2,15.54 3.2,17.68 4.42,18.9 4.88,18.9 4.98,19 U1.R1
CHAN18
  Top 0.152: X2.24 1.37,8.99 1.37,10.06 2.29,10.97 2.29,13.11 2.59,13.41 2.59,15.39 2.9,15.7 2.9,17.83 3.2,18.14 3.2,20.12 3.5,20.42 3.5,21.34 3.66,21.49 5.49,21.49 U1.M2
CHAN19
  Top 0.152: X2.25 1.37,11.53 1.37,12.65 2.29,13.56 2.29,15.54 2.59,15.85 2.59,17.98 2.9,18.29 2.9,20.27 3.2,20.57 3.2,21.49 3.5,21.79 4.57,21.79 4.72,21.95 4.88,21.95 4.93,22 U1.M1
CHAN20
  Top 0.152: U1.K3 6.5,23.5 3.54,23.5 2.9,22.86 2.9,20.73 2.59,20.42 2.59,18.44 2.29,18.14 2.29,16 1.37,15.09 1.37,14.07 X2.26
CHAN21
  Top 0.152: U1.J4 7.5,24.5 3.32,24.5 2.9,24.08 2.9,23.32 2.59,23.01 2.59,20.88 2.29,20.57 2.29,18.59 1.37,17.68 1.37,16.61 X2.27
CHAN22
  Top 0.152: X2.28 1.37,19.15 1.37,20.12 2.29,21.03 2.29,23.16 2.59,23.47 2.59,24.54 4.27,26.21 4.88,26.21 5,26.09 U1.H1
CHAN23
  Top 0.152: X2.29 1.37,21.69 1.37,22.71 2.29,23.62 2.29,24.69 4.12,26.52 5.49,26.52 U1.H2
CHAN24
  Top 0.152: X2.30 2.44,25.3 2.44,26.98 3.66,28.19 4.88,28.19 5,28.07 U1.F1
CHAN25
  Top 0.152: U1.F2 5.99,28 5.49,28.5 3.1,28.5 X2.31
CHAN26
  Top 0.152: U1.E1 1.48,29 X2.32
CHAN27
  Top 0.152: U1.E2 5.5,29.5 3.52,29.5 X2.33
CHAN28
  Top 0.152: U1.C1 4.97,31 4.88,31.09 3.96,31.09 1.68,33.38 1.68,33.88 X2.34
CHAN29
  Top 0.152: X2.35 2.9,35.2 2.9,32.61 3.96,31.55 4.57,31.55 5,31.98 U1.B1
CHAN30
  Top 0.152: U1.B2 5.5,32.5 5.5,33.36 5.18,33.68 3.66,33.68 3.2,34.14 3.2,37.44 X2.36
CHAN31
  Top 0.152: U1.A2 6,33.32 5.33,33.98 3.81,33.98 3.5,34.29 3.5,39.67 X2.37
CHAN-CLK
  Top 0.152: U1.T7 11,15.11 13.26,12.85 17.37,12.85 17.68,12.55 17.68,8.69 22.5,3.86 22.5,2.9 X2.1
CKE  (via drill 0.33)
  Top 0.152: U1.J12 v16.5,24.5
  Bottom 0.152: U3.37 16.85,24.15 v16.5,24.5
D0  (via drill 0.33)
  Top 0.152: U1.P6 10.5,19.5 10.54,19.5 10.54,17.65 10.67,17.53 10.67,12.63 v10.52,12.48
  Bottom 0.152: U3.2 6.68,11.35 9.36,11.35 v10.52,12.48
D1  (via drill 0.33)
  Top 0.152: U1.T6 10,17.71 10.21,17.5 10.21,16.73 10.03,16.56 v10.03,16.51
  Bottom 0.152: U3.4 7.49,12.95 10.03,15.49 v10.03,16.51
D2  (via drill 0.33)
  Top 0.152: U1.T5 8.84,17.83 8.84,16.79 v9.12,16.52
  Bottom 0.152: U3.5 6.44,13.87 7.77,13.87 9.12,15.21 v9.12,16.52
D3  (via drill 0.33)
  Top 0.152: U1.P5 8.5,19.5 8.5,16.5 v7.49,15.49
  Bottom 0.152: v7.49,15.49 7.37,15.37 6.33,15.37 U3.7
D4  (via drill 0.33)
  Top 0.152: U1.R5 9.5,18.5 v9.5,17.39
  Bottom 0.152: U3.8 6.42,16.26 7.11,16.26 7.24,16.38 7.75,16.38 8.76,17.4 9.12,17.4 v9.5,17.39
D5  (via drill 0.33)
  Top 0.152: v8.5,20.5 U1.N5
  Bottom 0.152: U3.10 8,17.75 8.38,18.14 8.38,20.38 v8.5,20.5
D6  (via drill 0.33)
  Top 0.152: v7.5,19.5 U1.P4
  Bottom 0.152: U3.11 6.67,18.55 7.62,19.36 v7.5,19.5
D7  (via drill 0.33)
  Top 0.152: v7.5,20.5 U1.N4
  Bottom 0.152: U3.13 7.15,20.15 v7.5,20.5
D8  (via drill 0.33)
  Top 0.152: U1.P12 v16.5,19.5
  Bottom 0.152: v16.5,19.5 16.76,19.76 16.87,19.76 17.22,20.12 17.64,20.12 U3.42
D9  (via drill 0.33)
  Top 0.152: U1.R12 v16.5,18.5
  Bottom 0.152: U3.44 16.55,18.55 v16.5,18.5
D10  (via drill 0.33)
  Top 0.152: v16.5,17.5 U1.T13
  Bottom 0.152: U3.45 16.75,17.75 v16.5,17.5
D11  (via drill 0.33)
  Top 0.152: v16.5,16.5 U1.T14
  Bottom 0.152: U3.47 16.85,16.15 v16.5,16.5
D12  (via drill 0.33)
  Top 0.152: U1.R14 18.5,18.5 18.5,16.81 v19.05,16.26
  Bottom 0.152: U3.48 18.53,15.35 19.05,15.88 v19.05,16.26
D13  (via drill 0.33)
  Top 0.152: U1.T15 19,17.32 19.66,16.66 19.66,16.54 v19.94,16.26
  Bottom 0.152: U3.50 18.45,13.75 18.8,14.1 18.8,15.11 v19.94,16.26
D14  (via drill 0.33)
  Top 0.152: U1.T12 16,17.98 15.85,17.83 15.85,15.47 15.24,14.86 15.24,14.2 v15.54,13.89
  Bottom 0.152: U3.51 16.49,12.95 v15.54,13.89
D15  (via drill 0.33)
  Top 0.152: U1.P11 15.05,20 15.54,19.51 15.54,15.85 15.24,15.54 v15.09,15.54
  Bottom 0.152: U3.53 16.23,11.35 14.94,12.65 14.94,15.39 v15.09,15.54
DONE
  Bottom 0.152: U2.16 6.8,43.95 7.01,43.74 10.06,43.74 11.58,45.26 17.07,45.26 18.75,43.59 18.75,37.49 16.92,35.66 16.92,35.05 16.31,34.44 15.85,34.44 15.24,35.05 15,35.05 R4.8
FLASH-CS#  (via drill 0.33)
  Top 0.152: U1.T3 7,17.67 4.42,15.09 4.42,9.91 4.72,9.6 5.64,9.6 v5.79,9.75
  Bottom 0.152: v5.79,9.75 5.64,9.75 5.33,9.45 5.33,6.71 5.64,6.4 6.14,6.4 R2.4 | R2.4 6.18,6.4 | R2.4 6.16,2.99 7.37,1.78 9.26,1.78 U4.1
FPGA-CCLK  (via drill 0.33)
  Top 0.152: U1.R11 14.5,18.5 14.5,17.7 14.33,17.53 14.33,16.46 v14.48,16.31 | X3.5 16.83,6.9 v16.92,6.99
  Bottom 0.152: v14.48,16.31 14.48,12.22 16.92,9.78 v16.92,6.99 16.92,4.72 16.61,4.42 15.14,4.42 U4.6
FPGA-CLK  (via drill 0.33)
  Top 0.152: v13.5,32.5 U1.A9
  Bottom 0.152: R4.13 12.65,32.65 v13.5,32.5
FPGA-DONE  (via drill 0.33)
  Top 0.152: U1.P13 v16.5,20.5
  Bottom 0.152: R4.9 14.65,33.2 14.78,33.07 14.78,20.85 14.82,20.85 15.09,20.57 16.43,20.57 v16.5,20.5
FPGA-INIT#  (via drill 0.33)
  Top 0.152: U1.R3 6.5,18.5 6.5,17.78 4.12,15.39 4.12,9.3 4.57,8.84 7.16,8.84 v7.32,8.99
  Bottom 0.152: R2.1 7.11,8.78 v7.32,8.99
FPGA-MISO  (via drill 0.33)
  Top 0.152: U1.P10 13.5,19.5 13.5,17.77 12.95,17.22 v12.95,16.61
  Bottom 0.152: R9.2 12.19,9.91 12.95,10.67 v12.95,16.61
FPGA-MOSI  (via drill 0.33)
  Top 0.152: U1.T10 14,17.2 13.87,17.07 13.87,15.7 v13.72,15.7 | X3.3 13.63,9.1 v13.59,9.14
  Bottom 0.152: v13.72,15.7 13.72,9.27 v13.59,9.14 13.59,5.97 13.84,5.71 15.02,5.71 U4.5
FPGA-PROG_B  (via drill 0.33)
  Top 0.152: U1.T2 5.5,17.5 5.5,17.39 3.81,15.7 3.81,8.84 4.72,7.92 7.16,7.92 v7.32,8.08
  Bottom 0.152: R4.14 12.15,31.89 14.48,29.57 14.48,24.48 13.5,23.5 11.75,23.5 10.75,22.5 10.75,15.09 11.25,14.59 11.25,12.01 v7.32,8.08 7.22,7.98 R2.2
FPGA-TCK  (via drill 0.33)
  Top 0.152: U1.C14 18.5,30.5 18.5,29.75 18.75,29.5 20.13,29.5 20.5,29.13 20.99,29.13 R5.2 23.08,30.09 v23.47,30.48
  Bottom 0.152: v23.47,30.48 23.32,30.48 23.01,30.63 23.01,33.07 21.95,34.29 20.42,34.29 20.27,34.44 16.76,34.44 16.46,34.14 15.7,34.14 15.09,34.75 14.02,34.75 13.72,34.44 13.72,33.86 R4.11
FPGA-TDI  (via drill 0.33)
  Top 0.152: U1.C12 15.5,31.5 14.75,31.5 14.5,31.25 14.5,30.75 14.25,30.5 12.75,30.5 12.5,30.75 12.5,32.25 12.25,32.5 v11.5,32.5
  Bottom 0.152: v11.5,32.5 11.5,33.14 11.58,33.22 11.58,33.72 R4.15
FPGA-TDO  (via drill 0.33)
  Top 0.152: U1.E14 18.5,28.5 v19.51,28.5
  Bottom 0.152: R4.10 14.15,34.27 14.33,34.44 14.94,34.44 16,33.38 18.59,33.38 19.2,32.77 19.2,31.39 18.9,31.09 18.9,29.11 v19.51,28.5
FPGA-TMS  (via drill 0.33)
  Top 0.152: U1.A15 18.5,33.5 v10.5,33.5
  Bottom 0.152: R4.16 10.79,33.8 v10.5,33.5
GND  (via drill 0.33, 0.5, 0.6)
  Top 0.152: U1.D4 v8.5,29.5 | U1.C4 v8.5,30.5 | U1.B7 v11.5,31.5 | U1.E9 v13.5,28.5 | U1.G8 v11.5,27.5 | U1.H7 v10.5,26.5 | v12.5,26.5 U1.H9 | U1.J8 v11.5,25.5 | U1.K7 v10.5,24.5 | v12.5,24.5 U1.K9 | U1.M8 v12.5,22.5 | U1.J5 9.2,25.2 | 9.2,25.2 v9.5,25.5 | U1.R6 v9.5,19.5 | 9.2,25.2 v8.5,24.5 | U1.R10 v14.5,19.5 14.5,20.5 U1.N11 | U1.B11 v15.5,32.5 | v19.5,22.5 U1.L15 | v20,17.25 U1.T16 | U1.D13 16.5,30.5 v15.5,30.5 | U1.A16 v19.5,33.5 | U1.G15 v19.5,26.5 | U1.G2 5.5,27.5 v4.5,27.5 | U1.L2 5.59,22.61 5.5,22.5 v4.5,22.5 | U1.P3 6.5,19.5 v4.5,19.5 | v4.5,17.5 U1.T1 | U1.H12 v15.5,25.5 | X1.5 10.93,45.92 10.93,46.53 10.82,46.63 v10.29,46.63 | LED1.C 6.2,48.35 C1.2 | U1.A1 4.33,33 v4.12,32.8 | v15.5,21.5 16.5,21.5 U1.N13 U1.P14 | R5.1 21.95,33.07 v21.79,33.22 | X3.G1 19.19,14.75 19.43,14.99 19.43,15.11 v20.19,15.11 | X3.6 17.51,5.8 v17.68,5.97 | X3.G2 6.49,1.13 v6.48,1.14
  Top 0.406: C5.2 16.08,35.59 v16,35.51 | C1.2 6.48,48.69 5.94,49.3 v5.41,49.3
  Top 0.61: U6.1 8.91,42.9 v8.38,42.37 | U7.1 21.11,42.6 v21.03,42.37 | C4.2 9.27,35.94 v8.84,35.51 | C24.2 15.91,36.88 C5.2 | v9.45,41.3 9.45,41.15 10.21,40.39 10.94,40.39 C35.2
  Bottom 0.152: 17.91,12.32 U3.52 16.8,12.15 v16.56,12.14 | v7.5,14.5 7.44,14.55 U3.6 6.18,14.7 C18.2 | U3.54 18.68,10.55 v19.05,10.92 20.11,10.92 C16.2 21.14,10.93 C10.2 v21.34,9.6 | U3.46 19.7,16.95 v20,17.25 20.24,17.49 C28.2 22.05,17.49 C7.2 21.34,16.37 C14.2 | U3.28 18.4,31.35 18.59,31.55 18.59,32.41 v18.5,32.5 | U3.12 4.65,19.35 v4.5,19.5 4.5,19.28 4.12,18.9 3.55,18.9 C33.2 | Q1.2 12.5,37.58 C3.2 13.96,37.49 C6.2 14.02,38.25 14.17,38.41 15.24,38.41 15.39,38.56 C13.2 | v9.45,41.3 Q1.4 | R2.7 3.56,7.98 v3.35,7.92 | C30.2 4.52,14.89 C18.2 | C34.2 4.52,12.99 C20.2 C18.2 | v17.68,5.97 C19.2 | 9.4,46.33 9.4,47.33 C8.2 R8.2 | 9.4,46.33 U2.20 | v10.29,46.63 9.55,46.63 9.4,46.33 | C27.2 15.59,39.05 C13.2 | C13.2 15.63,39.49 C2.2 v16.76,41.15 | C15.2 3.46,32.57 3.69,32.8 v4.12,32.8 | C12.2 C11.2 4.48,27.52 v4.5,27.5 | C25.2 3.5,24.5 C22.2 3.9,22.86 4.14,22.86 v4.5,22.5 | U3.41 17.63,21 U1.N13 16.5,21.5 v15.5,21.5 | v21.79,26.21 C17.2 21.59,27.54 C26.2 | C29.2 20.77,23.73 C9.2 20.53,23.53 v19.5,22.5 20.17,21.83 C32.2 20.77,22.03 C23.2 | v21.79,33.22 C21.2 21.59,31.89 C31.2 | U4.4 7.42,5.64 v7.24,5.59
  pour Route2: 0.64,50.16 24.77,50.16 24.77,0.64 0.64,0.64
LDQM  (via drill 0.33)
  Top 0.152: v7.5,21.5 U1.M4
  Bottom 0.152: U3.15 7.25,21.75 v7.5,21.5
LED
  Bottom 0.152: U2.5 6.8,37.4 7.01,37.19 7.92,37.19 8.38,36.73 12.95,36.73 13.11,36.58 13.11,35.59 R4.5
N$2
  Top 0.61: U7.4 U7.2 | U7.4 18.8,36.07 1.2V.1 | U7.4 17.88,38.05 17.53,38.41 16.09,38.41 C5.1
  Bottom 0.406: 1.2V.1 19.1,35.46 SHRT3.1
N$7
  Bottom 0.152: U2.6 6.15,37.13 6.4,36.88 7.77,36.88 8.23,36.42 12.5,36.42 12.65,36.27 12.65,35.55 R4.4
N$8  (via drill 0.33)
  Top 0.152: X3.7 12.22,4.7 v12.19,4.67
  Bottom 0.152: v7.32,3.2 7.42,3.1 U4.2 11.94,3.1 12.19,3.35 v12.19,4.67 R9.1
N$11  (via drill 0.33)
  Top 0.152: v2.74,41.45 2.74,43.28 v2.9,43.43 | v2.74,45.72 3.05,45.72 3.96,46.63 5.07,46.63 LED1.A
  Bottom 0.152: R4.12 13.15,34.24 12.95,34.44 10.36,34.44 9.3,33.38 9.3,32.16 8.84,31.7 7.32,31.7 5.64,33.38 3.35,33.38 2.44,34.29 2.44,41.15 v2.74,41.45 | v2.9,43.43 2.9,45.57 v2.74,45.72
OSC1
  Bottom 0.152: Q1.3 10.8,39.04 | Q1.3 10.8,38.84 10.36,38.86 9.91,38.41 9.91,37.34 9.75,37.19 8.99,37.19 8.84,37.34 8.84,38.39 U2.2 | C3.1 10.88,38.86 Q1.3
OSC2
  Bottom 0.152: C2.1 Q1.1 12.5,40.39 12.27,40.21 9.98,40.21 9.6,40.54 8.99,40.54 8.08,39.62 8.08,38.5 U2.3
PROG#
  Bottom 0.152: U2.7 5.5,37.35 4.72,36.58 3.66,36.58 3.35,36.27 3.35,34.75 3.81,34.29 8.84,34.29 10.67,36.12 12.04,36.12 12.19,35.97 12.19,35.59 R4.3
RAS#  (via drill 0.33)
  Top 0.152: v8.5,22.5 U1.L4
  Bottom 0.152: U3.18 7.85,24.15 8.53,23.47 8.53,22.53 v8.5,22.5
RST#  (via drill 0.33)
  Top 0.152: v7.62,40.23 7.62,40.54 9.14,42.06 14.78,42.06 15.24,42.52 v15.24,45.87
  Bottom 0.152: X2.20 22.86,48.26 22.86,45.72 21.8,44.66 R1.1 21.8,44.95 21.03,45.72 17.37,45.72 17.22,45.87 v15.24,45.87 | U2.4 7.45,40.06 v7.62,40.23
SD-CS#  (via drill 0.33)
  Top 0.152: U1.T8 12,16.04 v12.19,15.85 | X3.2 15.92,10.2 16.13,10.41 16.13,11.56 15.62,12.32 v12.19,12.32
  Bottom 0.152: v12.19,15.85 v12.19,12.32 12.19,11.89 7.47,7.16 v7.21,7.16 6.18,7.16 R2.3
SDRAM-CLK  (via drill 0.33)
  Top 0.152: U1.K12 v15.5,23.5 15.54,23.55 15.54,24.23 15.85,24.54 15.7,24.69 15.39,24.69 15.24,24.54 14.78,24.54 14.48,24.84 14.33,24.69 14.33,24.38 14.48,24.23 14.48,23.77 14.17,23.47 14.33,23.32 14.63,23.32 14.94,23.62 14.94,23.77 15,23.84 U1.K11
  Bottom 0.152: U3.38 15.73,23.35 v15.5,23.5
SDRAM-CS#  (via drill 0.33)
  Top 0.152: v8.5,25.5 U1.H4
  Bottom 0.152: v8.5,25.5 8.5,25.42 7.92,24.84 6.43,24.84 U3.19
SENSE-USB
  Bottom 0.152: U2.15 6.25,45.83 6.25,48.16 6.55,48.46 7.08,48.46 R8.1 7.47,48.86 7.47,49.53 7.62,49.68 10.21,49.68 10.43,49.47 R7.1
TCK  (via drill 0.33)
  Top 0.152: JP3.2 19.05,46.48 18.44,45.87 17.98,45.87 17.68,45.57 17.68,42.82 v17.6,42.75
  Bottom 0.152: R4.6 13.72,35.46 13.72,36.12 14.17,36.58 16.92,36.58 18.14,37.8 18.14,42.22 v17.6,42.75 17.07,43.28 16.08,43.28 14.86,42.14 10.59,42.14 9.6,43.13 4.72,43.13 3.55,44.31 U2.11
TDI  (via drill 0.33)
  Top 0.152: JP3.1 21.59,46.53 22.1,46.02 22.1,39.93 20.88,38.71 20.88,36.73 20.73,36.58 20.27,36.58 19.51,35.81 19.51,34.75 19.2,34.44 10.21,34.44 9.45,33.68 8.53,33.68 8.53,32.53 v8.5,32.5
  Bottom 0.152: U2.9 4.2,37.42 3.96,37.19 3.35,37.19 2.74,36.58 2.74,34.44 3.5,33.68 8.38,33.68 | 8.38,33.68 9.14,33.68 10.21,34.75 11.43,34.75 11.58,34.9 11.58,35.48 R4.2 | v8.5,32.5 8.5,33.56 8.38,33.68
TDO  (via drill 0.33)
  Top 0.152: v3.79,49.96 3.79,47.83 v3.96,47.7
  Bottom 0.152: R4.7 14.17,35.41 14.17,35.97 14.48,36.27 17.07,36.27 18.44,37.64 18.44,43.43 16.92,44.96 11.73,44.96 10.21,43.43 5.18,43.43 4.85,43.77 U2.13 4.88,45.76 4.88,47.09 4.27,47.7 v3.96,47.7 | v3.79,49.96 4.12,50.29 18.29,50.29 19.05,49.53 JP3.4
TMS  (via drill 0.33)
  Top 0.152: v2.9,49.99 2.44,49.53 2.44,46.33 v1.83,45.72
  Bottom 0.152: R4.1 10.81,35.36 10.35,35.35 8.99,33.98 3.66,33.98 3.05,34.59 3.05,36.42 3.5,36.88 4.27,36.88 4.85,37.46 U2.8 4.88,38.51 4.88,40.23 2.29,42.82 2.29,45.26 v1.83,45.72 | JP3.3 20.7,49.51 19.51,48.31 18.59,48.31 16.92,49.99 4.72,49.99 4.12,49.38 3.5,49.38 v2.9,49.99
UDQM  (via drill 0.33)
  Top 0.152: v16.5,22.5 U1.L13
  Bottom 0.152: U3.39 16.55,22.55 v16.5,22.5
USB_D+  (via drill 0.33)
  Top 0.152: v12.65,47.24 12.65,45.97 X1.3
  Bottom 0.152: U2.19 8.75,44.59 8.99,44.35 9.75,44.35 11.43,46.02 12.5,46.02 12.8,46.33 12.8,47.09 v12.65,47.24
USB_D-  (via drill 0.33)
  Top 0.152: v13.56,47.24 13.56,45.98 X1.2
  Bottom 0.152: U2.18 8.1,44.33 8.38,44.04 9.91,44.04 11.58,45.72 12.95,45.72 13.56,46.33 v13.56,47.24
VUSB
  Bottom 0.152: U2.17 7.45,47.58 C8.1
WE#  (via drill 0.33)
  Top 0.152: U1.M3 7.2,22.19 v7.5,22.5
  Bottom 0.152: U3.16 7.45,22.55 v7.5,22.5

### Text on the board
tPlace: TDO | AI1 | TMS | RS | AI0 | TCK | 5V | 1V | 5V | TDI | GND | 31 | 3V | 30 | 14 | 29 | 3V | 1V | 13 | 28 | 12 | 11 | 27 | 26 | 10 | 25 | 9 | 24 | 8 | 23 | 7 | 22 | 6 | 21 | 5 | 4 | 20 | 19 | 3 | 18 | 2 | 17 | 1 | 16 | 0 | 15 | CLK
bPlace: 5V | c | 1V | 3V
tDocu: ANALOG-IO1 | RST# | ANALOG-IO0 | +1.2V | +5V | GND | CHAN31 A2 | +3.3V | CHAN30 B2 | CHAN14 B15 | CHAN29 B1 | CHAN13 B16 | CHAN28 C1 | CHAN12 C15 | CHAN27 E2 | CHAN11 C16 | CHAN26 E1 | CHAN10 F16 | CHAN25 F2 | CHAN9 F15 | CHAN24 F1 | CHAN8 J14 | CHAN23 H2 | CHAN7 J16 | CHAN22 H1 | CHAN6 K16 | CHAN21 J4 | CHAN5 K15 | CHAN20 K3 | CHAN4 M16 | CHAN19 M1 | CHAN3 M15 | CHAN18 M2 | CHAN2 R16 | CHAN17 R1 | CHAN1 R15 | CHAN16 R2 | CHAN0 R7 | CHAN15 T4 | CHAN-CLK T7 | 2012, XESS Corp. | Some rights reserved. | Licensed under a Creative Commons | Attribution-Share-Alike Unported License. | See creativecommons.org/licenses/by-sa/3.0/
text: 0.664" | 0.616" | 0.382" | 0.334" | 0.05" | 0.1" | 2.00" | 1.90" | 0.05" | 0.9" | 0.05" | 1.00"